# Altium project EE4951_BPM_REV_A.PrjPcb
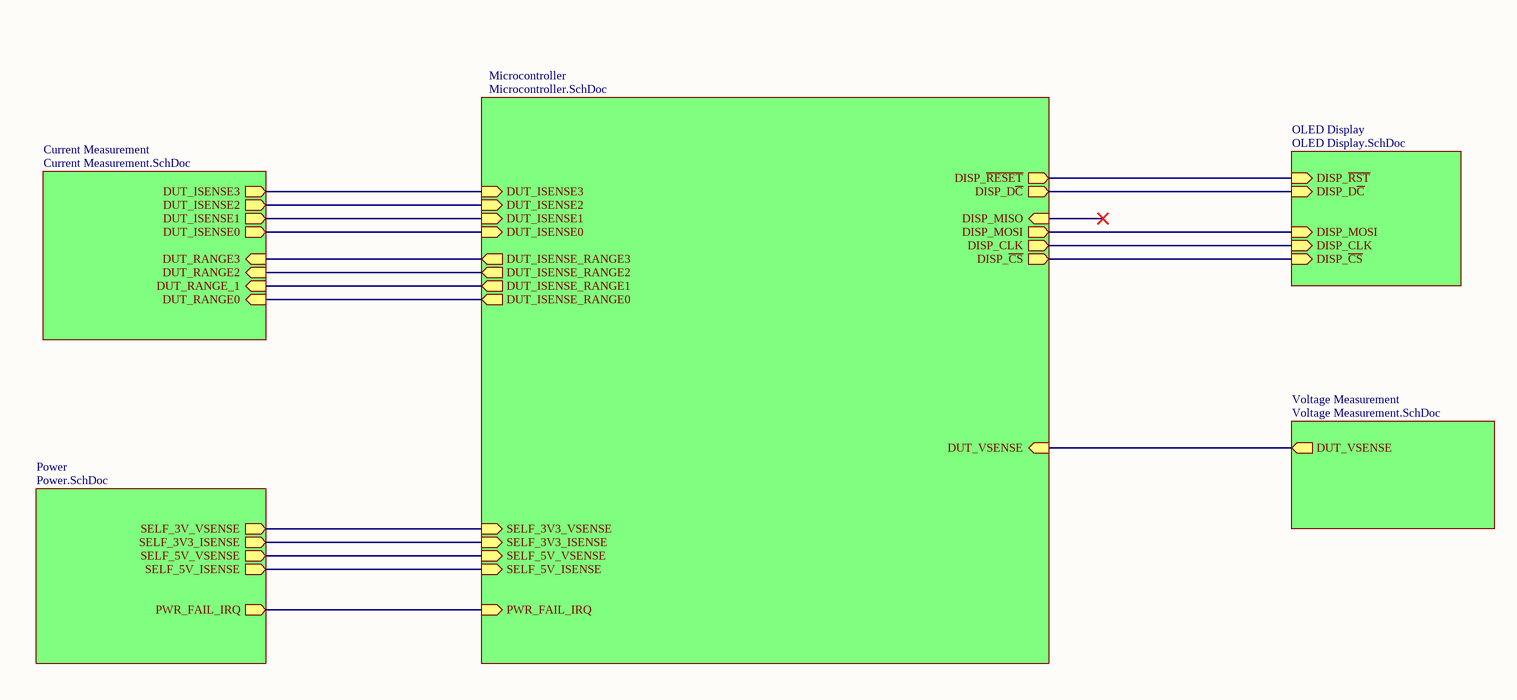
[diagram p0: Heirarchy.SchDoc, left]
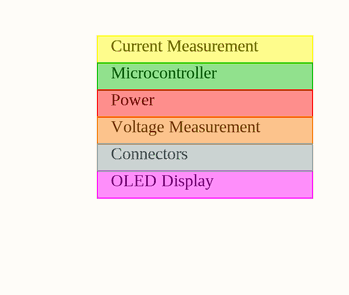
[diagram p1: Heirarchy.SchDoc, right]
6 sheets, 227 parts. Net scope: hierarchical (ports join the sheet entries above them; power ports are global).
Board file: EE4951_BPM_REVA.PcbDoc
Sheets:
  Heirarchy.SchDoc
    Current Measurement = Current Measurement.SchDoc
    Microcontroller = Microcontroller.SchDoc
    Power = Power.SchDoc
    Voltage Measurement = Voltage Measurement.SchDoc
    OLED Display = OLED Display.SchDoc

## Sheet Heirarchy.SchDoc
size D; DrawnBy: Ross Harvey; Engineer: Ross Harvey; Revision: A; SheetNumber: 1; SheetTotal: 7

### Sub-sheets
Current Measurement = Current Measurement.SchDoc: DUT_ISENSE2 (out), DUT_ISENSE1 (out), DUT_RANGE2 (in), DUT_RANGE0 (in), DUT_ISENSE3 (out), DUT_RANGE3 (in), DUT_RANGE_1 (in), DUT_ISENSE0 (out)
Microcontroller = Microcontroller.SchDoc: DISP_MISO (in), SELF_3V3_ISENSE (in), DISP_CLK (out), PWR_FAIL_IRQ (in), DISP_~{CS} (out), DUT_ISENSE_RANGE1 (out), SELF_5V_VSENSE (in), DUT_ISENSE_RANGE0 (out), DISP_MOSI (out), SELF_5V_ISENSE (in), DUT_VSENSE (in), DUT_ISENSE_RANGE2 (out), DISP_D~{C} (out), DUT_ISENSE_RANGE3 (out), DUT_ISENSE0 (in), DISP_~{RESET} (out), DUT_ISENSE2 (in), DUT_ISENSE3 (in), DUT_ISENSE1 (in), SELF_3V3_VSENSE (in)
OLED Display = OLED Display.SchDoc: DISP_~{CS} (in), DISP_CLK (in), DISP_MOSI (in), DISP_~{RST} (in), DISP_D~{C} (in)
Power = Power.SchDoc: SELF_5V_VSENSE (out), SELF_5V_ISENSE (out), SELF_3V3_ISENSE (out), PWR_FAIL_IRQ (out), SELF_3V_VSENSE (out)
Voltage Measurement = Voltage Measurement.SchDoc: DUT_VSENSE (out)

### Nets
DISP_~{CS}: sheet Microcontroller/DISP_~{CS}, sheet OLED Display/DISP_~{CS}
DISP_CLK: sheet Microcontroller/DISP_CLK, sheet OLED Display/DISP_CLK
DISP_MOSI: sheet Microcontroller/DISP_MOSI, sheet OLED Display/DISP_MOSI
DUT_ISENSE0: sheet Current Measurement/DUT_ISENSE0, sheet Microcontroller/DUT_ISENSE0
DUT_ISENSE1: sheet Current Measurement/DUT_ISENSE1, sheet Microcontroller/DUT_ISENSE1
DUT_ISENSE2: sheet Current Measurement/DUT_ISENSE2, sheet Microcontroller/DUT_ISENSE2
DUT_ISENSE3: sheet Current Measurement/DUT_ISENSE3, sheet Microcontroller/DUT_ISENSE3
DUT_ISENSE_RANGE0: sheet Current Measurement/DUT_RANGE0, sheet Microcontroller/DUT_ISENSE_RANGE0
DUT_ISENSE_RANGE1: sheet Current Measurement/DUT_RANGE_1, sheet Microcontroller/DUT_ISENSE_RANGE1
DUT_ISENSE_RANGE2: sheet Current Measurement/DUT_RANGE2, sheet Microcontroller/DUT_ISENSE_RANGE2
DUT_ISENSE_RANGE3: sheet Current Measurement/DUT_RANGE3, sheet Microcontroller/DUT_ISENSE_RANGE3
DUT_VSENSE: sheet Microcontroller/DUT_VSENSE, sheet Voltage Measurement/DUT_VSENSE
PWR_FAIL_IRQ: sheet Microcontroller/PWR_FAIL_IRQ, sheet Power/PWR_FAIL_IRQ
SELF_3V3_ISENSE: sheet Microcontroller/SELF_3V3_ISENSE, sheet Power/SELF_3V3_ISENSE
SELF_3V3_VSENSE: sheet Microcontroller/SELF_3V3_VSENSE, sheet Power/SELF_3V_VSENSE
SELF_5V_ISENSE: sheet Microcontroller/SELF_5V_ISENSE, sheet Power/SELF_5V_ISENSE
SELF_5V_VSENSE: sheet Microcontroller/SELF_5V_VSENSE, sheet Power/SELF_5V_VSENSE
NetU1_79: sheet Microcontroller/DISP_~{RESET}, sheet OLED Display/DISP_~{RST}
NetU1_80: sheet Microcontroller/DISP_D~{C}, sheet OLED Display/DISP_D~{C}

### Notes on the sheet
- Current Measurement
- Microcontroller
- Power
- Voltage Measurement
- Connectors
- OLED Display

## Sheet Current Measurement.SchDoc
size C; DrawnBy: Ross Harvey; Engineer: Ross Harvey; Revision: A; SheetNumber: 2; SheetTotal: 7
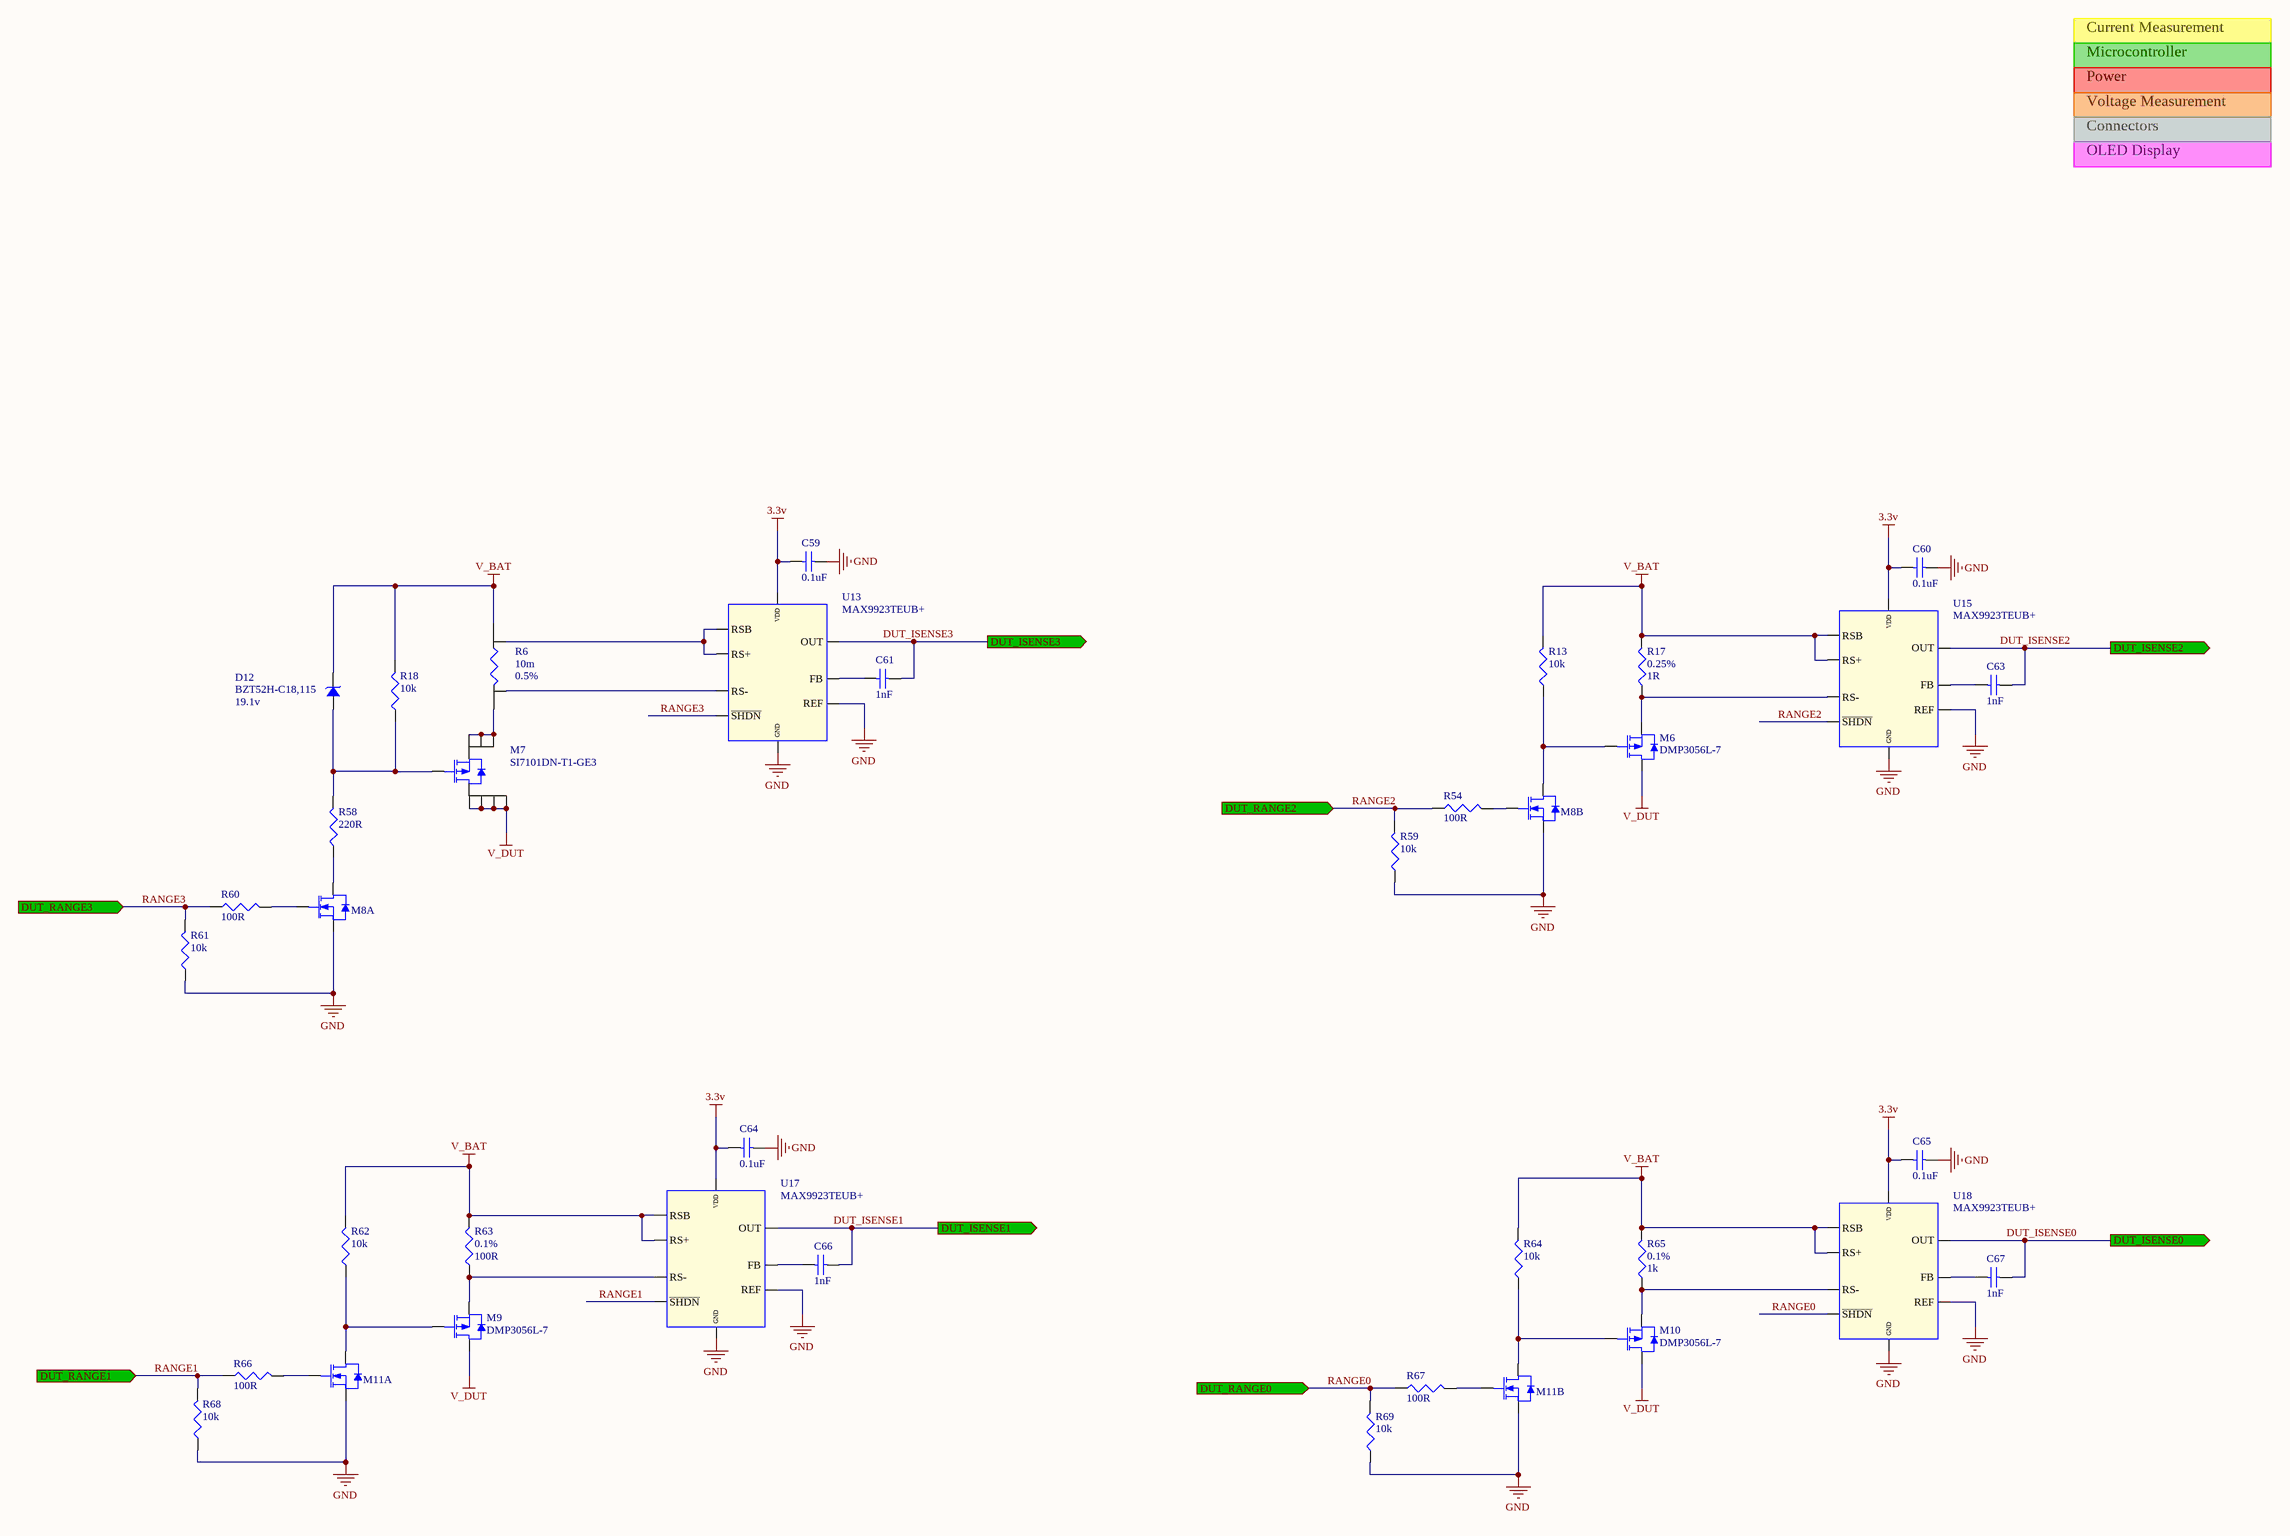
[diagram p2: Current Measurement.SchDoc]

### Parts
C59  0.1uF  [CAP0402R]
C60  0.1uF  [CAP0402R]
C61  1nF  [CAP0402R]
C63  1nF  [CAP0402R]
C64  0.1uF  [CAP0402R]
C65  0.1uF  [CAP0402R]
C66  1nF  [CAP0402R]
C67  1nF  [CAP0402R]
D12  BZT52H-C18,115  OPER_VOLTAGE: 19.1v  [SOD-123]
M6  DMP3056L-7  [SOT23-3M]
M7  SI7101DN-T1-GE3  [PowerPAK-1212-8]
M8  NX3020NAKV,115  [SOT666-6N]  (value not drawn)  (parts A,B of 2)
M9  DMP3056L-7  [SOT23-3M]
M10  DMP3056L-7  [SOT23-3M]
M11  NX3020NAKV,115  [SOT666-6N]  (value not drawn)  (parts A,B of 2)
R6  10m  TOLERANCE: 0.5%  [2512 4 Terminal]
R13  10k  [RES0603R]
R17  Tolerance: 0.25%  [RES0805R]  (hidden comment: 1R)
R18  10k  [RES0603R]
R54  100R  [RES0402R]
R58  220R  [RES0603R]
R59  10k  [RES0402R]
R60  100R  [RES0402R]
R61  10k  [RES0402R]
R62  10k  [RES0603R]
R63  Tolerance: 0.1%  [RES0603W]  (hidden comment: 100R)
R64  10k  [RES0603R]
R65  Tolerance: 0.1%  [RES0603W]  (hidden comment: 1k)
R66  100R  [RES0402R]
R67  100R  [RES0402R]
R68  10k  [RES0402R]
R69  10k  [RES0402R]
U13  MAX9923TEUB+  [uMAX10]
U15  MAX9923TEUB+  [uMAX10]
U17  MAX9923TEUB+  [uMAX10]
U18  MAX9923TEUB+  [uMAX10]

### Ports
DUT_ISENSE0 (out), DUT_ISENSE1 (out), DUT_ISENSE2 (out), DUT_ISENSE3 (out), DUT_RANGE0 (in), DUT_RANGE1 (in), DUT_RANGE2 (in), DUT_RANGE3 (in)

### Nets
3.3v: C59.1 C60.1 C64.1 C65.1 U13.10(VDD) U15.10(VDD) U17.10(VDD) U18.10(VDD)
GND: C59.2 C60.2 C64.2 C65.2 M8.1(S1) M8.4(S2) M11.1(S1) M11.4(S2) R59.1 R61.1 R68.1 R69.1 U13.5(GND) U13.7(REF) U15.5(GND) U15.7(REF) U17.5(GND) U17.7(REF) U18.5(GND) U18.7(REF)
V_BAT: D12.1(K) R6.3 R13.2 R17.2 R18.2 R62.2 R63.2 R64.2 R65.2 U15.1(RSB) U15.2(RS+) U17.1(RSB) U17.2(RS+) U18.1(RSB) U18.2(RS+)
V_DUT: M6.3(SOURCE) M7.5 M7.6 M7.7 M7.8 M9.3(SOURCE) M10.3(SOURCE)
DUT_ISENSE0: C67.2 U18.9(OUT) ; port DUT_ISENSE0
DUT_ISENSE1: C66.2 U17.9(OUT) ; port DUT_ISENSE1
DUT_ISENSE2: C63.2 U15.9(OUT) ; port DUT_ISENSE2
DUT_ISENSE3: C61.2 U13.9(OUT) ; port DUT_ISENSE3
RANGE0: R67.1 R69.2 U18.6(~{SHDN}) ; port DUT_RANGE0  [project net DUT_ISENSE_RANGE0]
RANGE1: R66.1 R68.2 U17.6(~{SHDN}) ; port DUT_RANGE1
RANGE2: R54.1 R59.2 U15.6(~{SHDN}) ; port DUT_RANGE2  [project net DUT_ISENSE_RANGE2]
RANGE3: R60.1 R61.2 U13.6(~{SHDN}) ; port DUT_RANGE3  [project net DUT_ISENSE_RANGE3]
NetC61_1: C61.1 U13.8(FB)
NetC63_1: C63.1 U15.8(FB)
NetC66_1: C66.1 U17.8(FB)
NetC67_1: C67.1 U18.8(FB)
NetD12_2: D12.2(A) M7.4 R18.1 R58.2
NetM6_1: M6.1(GATE) M8.3(D2) R13.1
NetM6_2: M6.2(DRAIN) R17.1 U15.3(RS-)
NetM7_1: M7.1 M7.2 M7.3 R6.1
NetM8_2: M8.2(G1) R60.2
NetM8_5: M8.5(G2) R54.2
NetM8_6: M8.6(D1) R58.1
NetM9_1: M9.1(GATE) M11.6(D1) R62.1
NetM9_2: M9.2(DRAIN) R63.1 U17.3(RS-)
NetM10_1: M10.1(GATE) M11.3(D2) R64.1
NetM10_2: M10.2(DRAIN) R65.1 U18.3(RS-)
NetM11_2: M11.2(G1) R66.2
NetM11_5: M11.5(G2) R67.2
NetR6_2: R6.2 U13.3(RS-)
NetR6_4: R6.4 U13.1(RSB) U13.2(RS+)

Not connected (* = marked no-connect by the designer): U13 4(NC); U15 4(NC); U17 4(NC); U18 4(NC)

### Notes on the sheet
- Current Measurement
- Microcontroller
- Power
- Voltage Measurement
- Connectors
- OLED Display

### Library data of the parts
C59 C60 C64 C65 = 0.1uF (0402): Tolerance: 20%; MFG_PN: VJ0402G104MXQCW1BC; MFG: Vishay; Voltage: 10v; LOAD: NL; Value: 0.1uF
C61 C63 C66 C67 = 1nF (0402): Tolerance: 10%; MFG_PN: VJ0402Y102KXAAC; MFG: Vishay; Voltage: 50v; LOAD: NL; Value: 1nF
D12 = BZT52H-C18: 19.1v Zener Diode; MFG: NXP; LOAD: NL; CURRENT: 250mA; MFG_PN: BZT52H-C18,115
M6 M9 M10 = DMP3056L: PFET_SINGLE_4.3A_30v; LOAD: NL; MFG: DIODES_INC; VDS_MAX: -30v; I_MAX: -4.3A; VGS_MAX: 25v; P_MAX: 1.38W; RDS_ON: 35m; VGS_TH: -1v; MFG_PN: DMP3056L-7
M7 = SI7101DN: PFET_SINGLE_35A_30v; MFG: VISHAY; LOAD: NL; CURRENT: 35A; VGS_MAX: 20V; VDS_MAX: 30V; RDS: 7.2m; POWER: 52W; MFG_PN: SI7101DN-T1-GE3
M8 M11 = NX3020NAKV: NFET_DUAL_200mA_30v; LOAD: NL; MFG: NXP; VDS_MAX: 30v; I_MAX: 200mA; P_MAX: 1.1W; RDS_ON: 2.7; VGS_MAX: *; MFG_PN: NX3020NAKV,115
R6 = 10m 0.5% (2512 4-Terminal): 10mR Current Sense - 4-Terminal; MFG_PN: WSK2512R0100DEA; MFG: VISHAY; POWER: 1W; LOAD: NL; VALUE: 10m
R13 R18 R62 R64 = 10K (0603): Tolerance: 1%; POWER: 0.1W; MFG_PN: CRCW060310K0FKEA; MFG: Vishay; Load: NL; Value: 10k
R17 = 1R 0.25% (0805): POWER: 100mW; MFG_PN: CRT0805-CY-1R00ELF; MFG: Bourns; Load: NL; Value: 1R
R54 R60 R66 R67 = 100R (0402): Tolerance: 1%; POWER: 63mW; MFG_PN: CRCW0402100RFKED; MFG: Vishay; Load: NL; Value: 100R
R58 = 220R (0603): Tolerance: 1%; POWER: 0.1W; MFG_PN: CRCW0603220RFKEB; MFG: Vishay; Load: NL; Value: 220R
R59 R61 R68 R69 = 10k (0402): Tolerance: 1%; POWER: 63mW; MFG_PN: CRCW040210K0FKED; MFG: Vishay; Load: NL; Value: 10k
R63 = 100R   0.1% (0603): POWER: 0.1W; MFG_PN: TNPW0603100RBEEA; MFG: Vishay; Load: NL; TEMP_COEF: 20ppm; Value: 100R
R65 = 1k   0.1% (0603): POWER: 0.1W; MFG_PN: TNPW06031K00BEEA; MFG: Vishay; Load: NL; TEMP_COEF: 25ppm; Value: 1k
U13 U15 U17 U18 = MAX9923TEUB+: Ultra-Precision High Side Current Shunt Amp; LOAD: NL; MFG: MAXIM; GBW: 50kHz; Vos: 25uV; Ib: 1pA; GAIN: 25V/V; MFG_PN: MAX9923TEUB+

## Sheet Microcontroller.SchDoc
size D; DrawnBy: Ross Harvey; Engineer: Ross Harvey; Revision: A; SheetNumber: 3; SheetTotal: 7
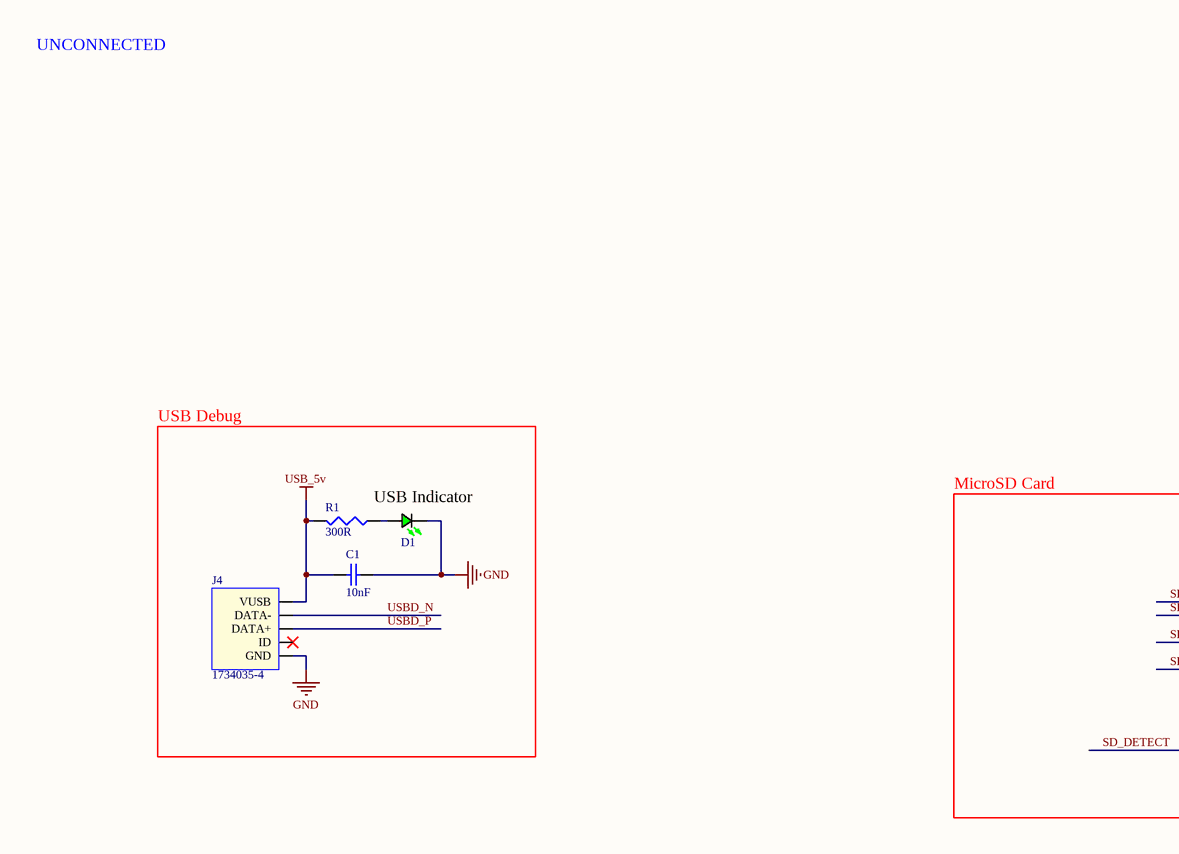
[diagram p3: Microcontroller.SchDoc, top left]
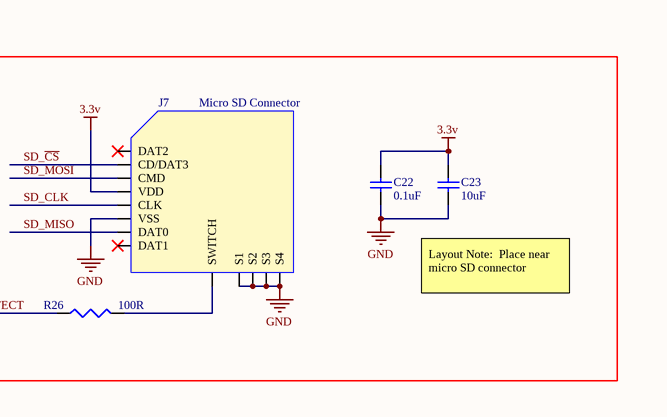
[diagram p4: Microcontroller.SchDoc, top middle]
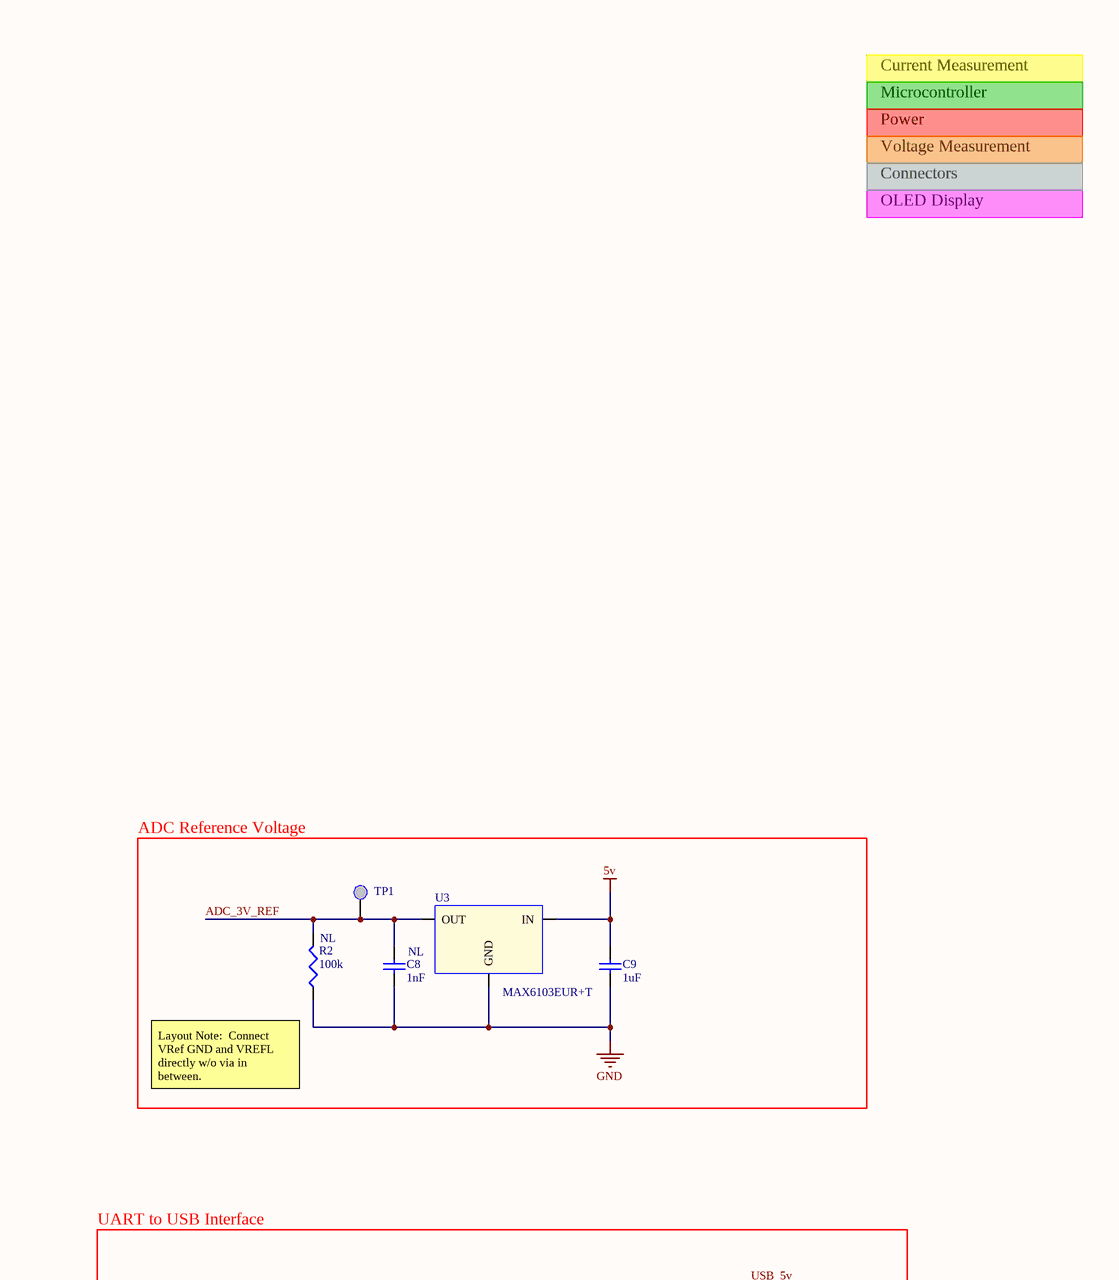
[diagram p5: Microcontroller.SchDoc, top right]
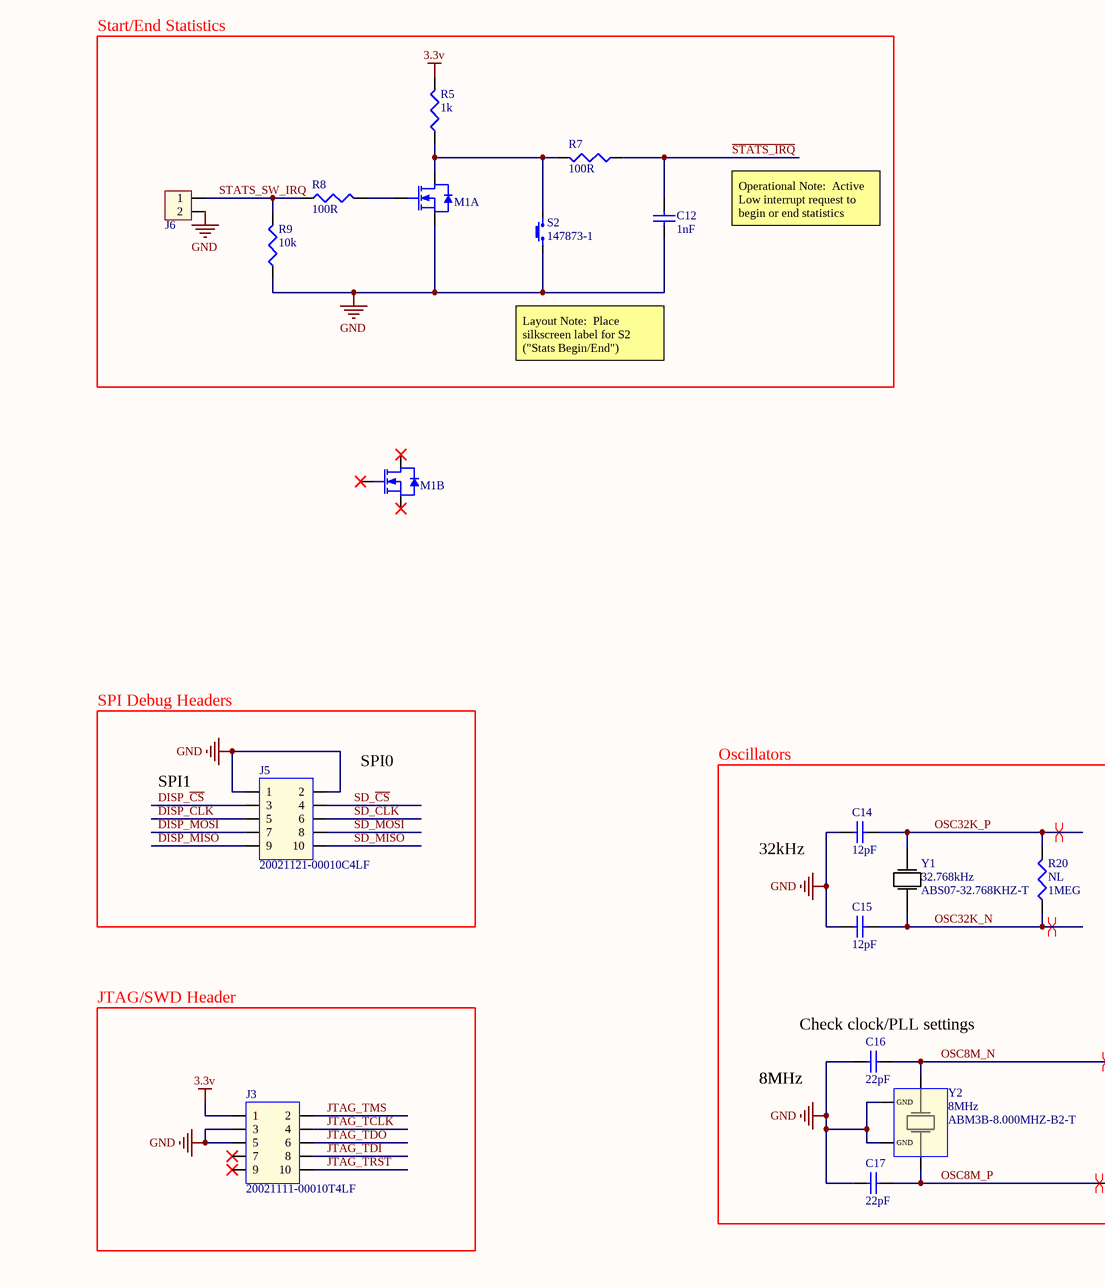
[diagram p6: Microcontroller.SchDoc, bottom left]
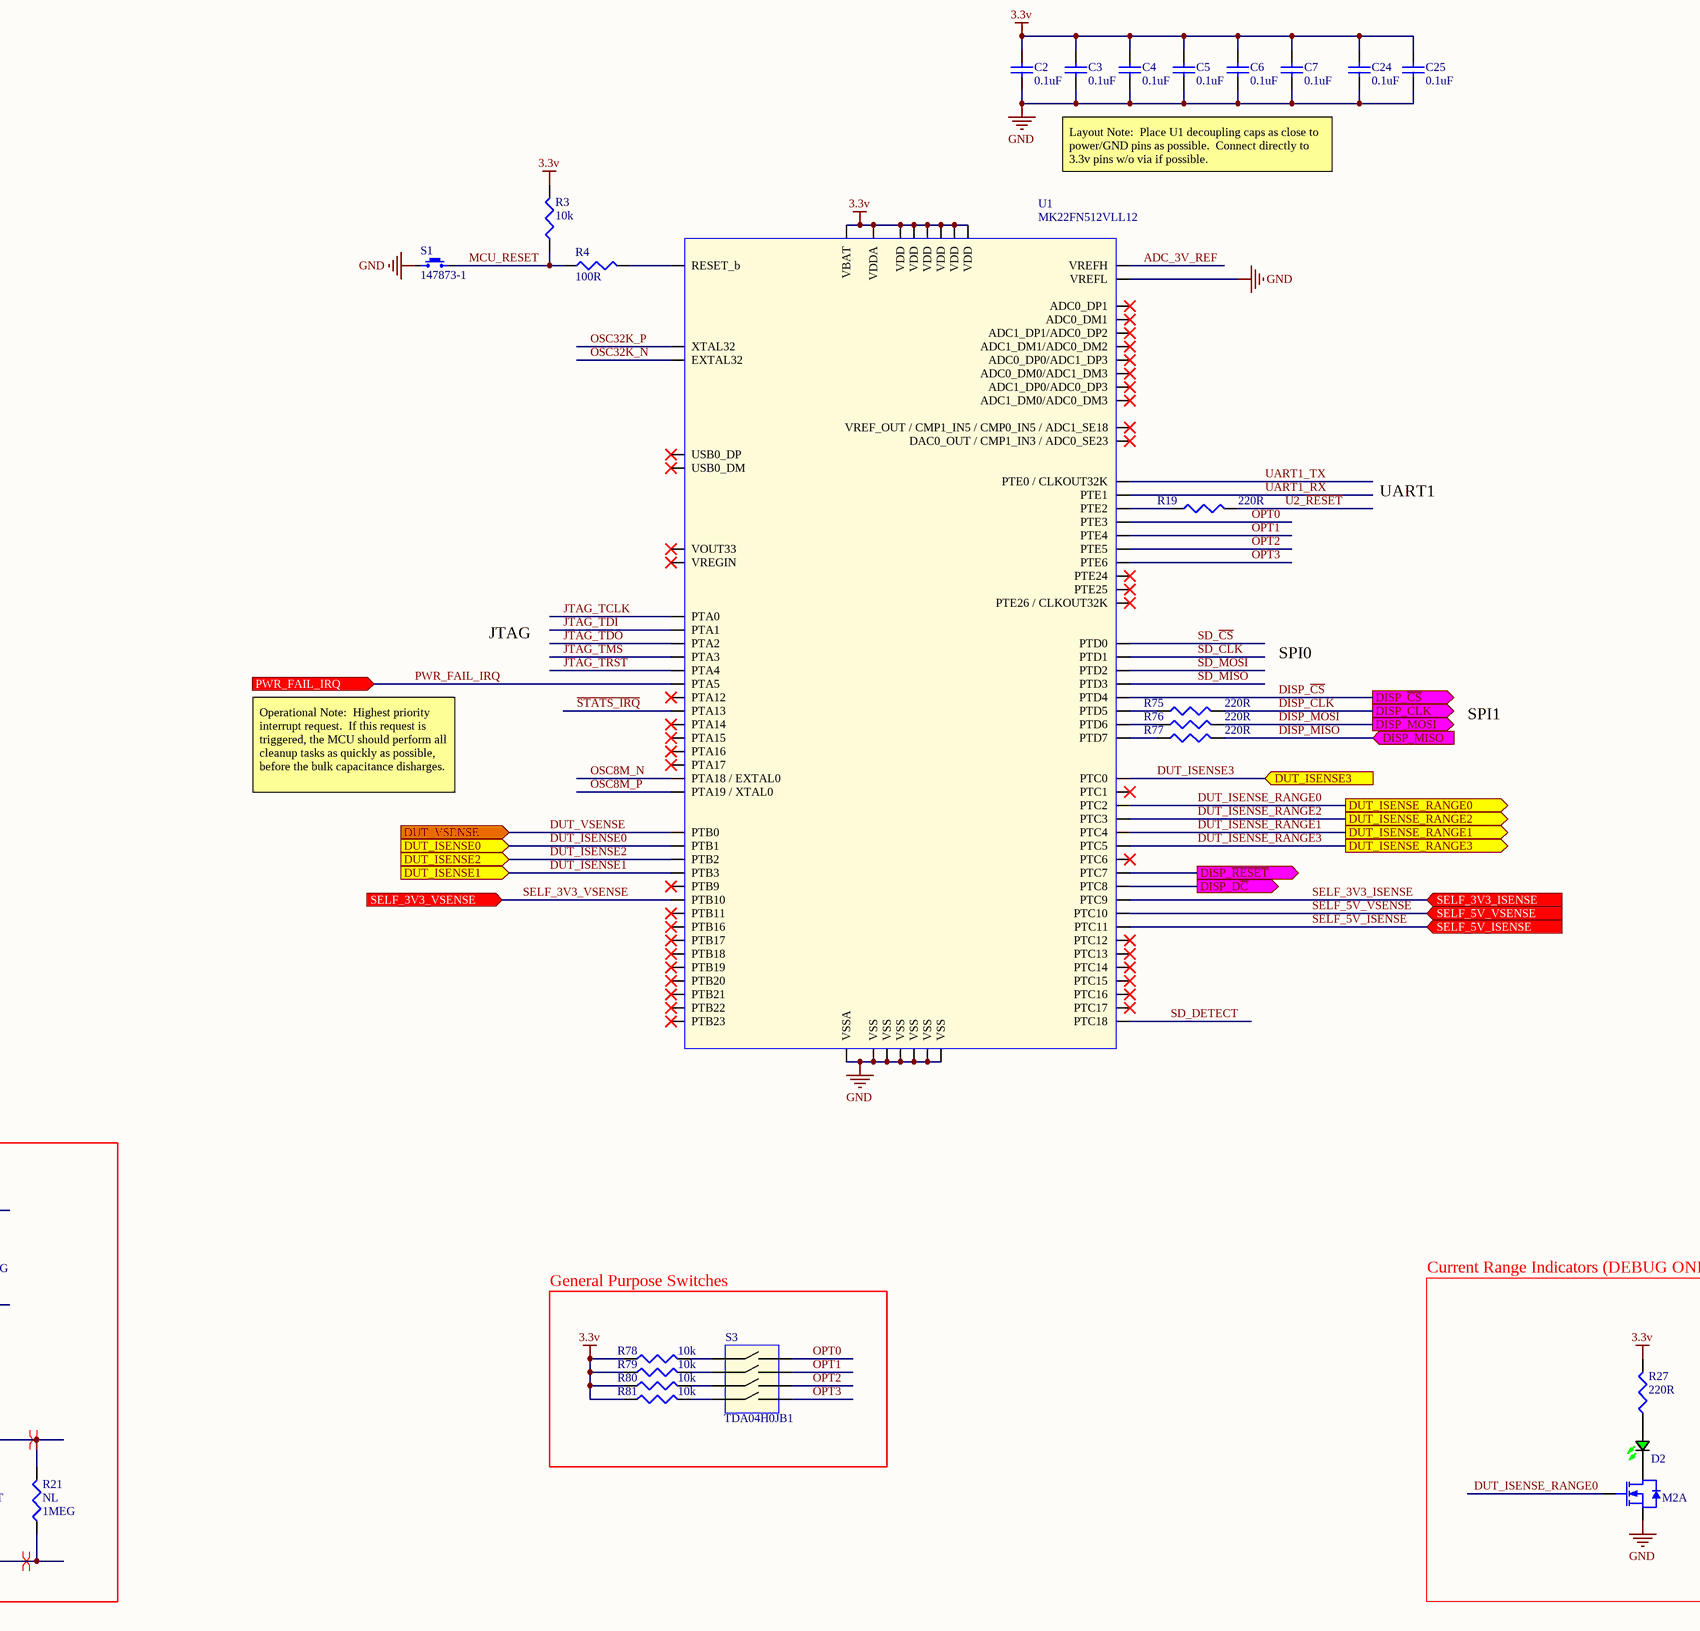
[diagram p7: Microcontroller.SchDoc, bottom middle]
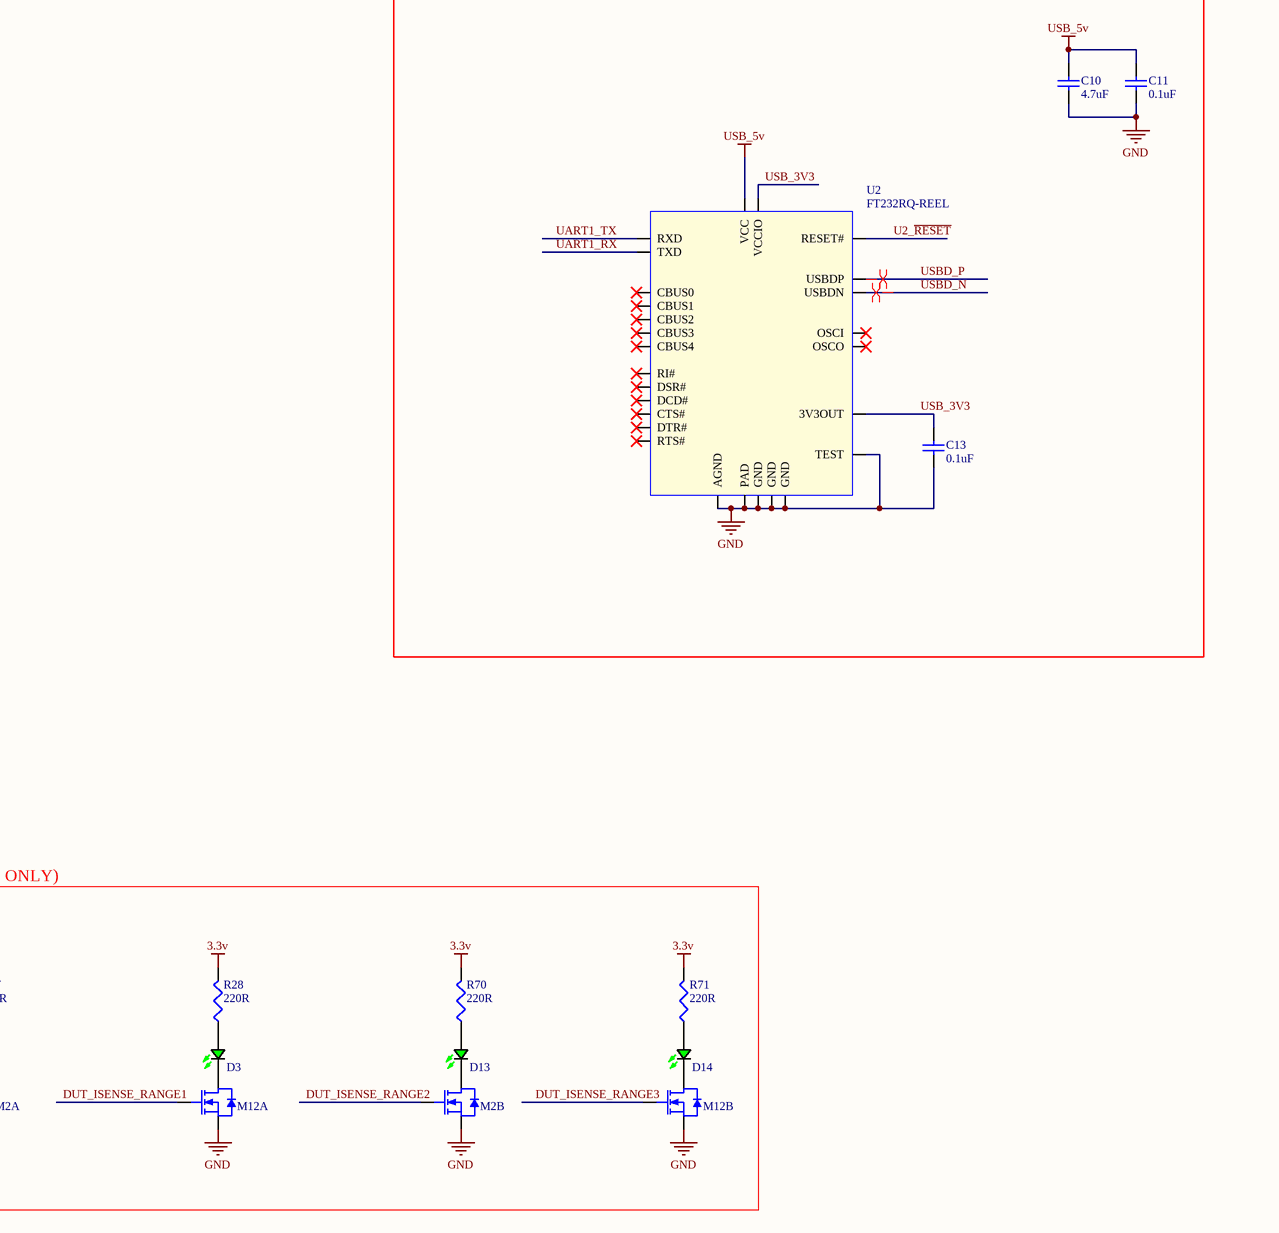
[diagram p8: Microcontroller.SchDoc, bottom right]

### Parts
C1  10nF  [CAP0402R]
C2  0.1uF  [CAP0402R]
C3  0.1uF  [CAP0402R]
C4  0.1uF  [CAP0402R]
C5  0.1uF  [CAP0402R]
C6  0.1uF  [CAP0402R]
C7  0.1uF  [CAP0402R]
C8  LOAD: NL  [CAP0402R]  (hidden comment: 1nF)
C9  1uF  [CAP0603R]
C10  4.7uF  [CAP0805R]
C11  0.1uF  [CAP0402R]
C12  1nF  [CAP0402R]
C13  0.1uF  [CAP0402R]
C14  12pF  [CAP0402R]
C15  12pF  [CAP0402R]
C16  22pF  [CAP0402R]
C17  22pF  [CAP0402R]
C22  0.1uF  [CAP0402R]
C23  10uF  [CAP1206R]
C24  0.1uF  [CAP0402R]
C25  0.1uF  [CAP0402R]
D1  LTST-S270KGKT  [LED Green 0603]  (value not drawn)
D2  LTST-S270KGKT  [LED Green 0603]  (value not drawn)
D3  LTST-S270KGKT  [LED Green 0603]  (value not drawn)
D13  LTST-S270KGKT  [LED Green 0603]  (value not drawn)
D14  LTST-S270KGKT  [LED Green 0603]  (value not drawn)
J3  20021111-00010T4LF  [2x5 Header (1.27mm)]
J4  1734035-4  [USB MINI-B 1734035-4]
J5  20021121-00010C4LF  [2x5 JTAG Header]
J6  1x2 Header  [1x2 Header]  (value not drawn)
J7  Micro SD Connector  [MICROSD_1050270001]
M1  NX3020NAKV,115  [SOT666-6N]  (value not drawn)  (parts A,B of 2)
M2  NX3020NAKV,115  [SOT666-6N]  (value not drawn)  (parts A,B of 2)
M12  NX3020NAKV,115  [SOT666-6N]  (value not drawn)  (parts A,B of 2)
R1  300R  [RES0402R]
R2  Load: NL  [RES0402R]  (hidden comment: 100k)
R3  10k  [RES0402R]
R4  100R  [RES0402R]
R5  1k  [RES0402R]
R7  100R  [RES0402R]
R8  100R  [RES0402R]
R9  10k  [RES0402R]
R19  220R  [RES0402R]
R20  Load: NL  [RES0402R]  (hidden comment: 1MEG)
R21  Load: NL  [RES0402R]  (hidden comment: 1MEG)
R26  100R  [RES0402R]
R27  220R  [RES0402R]
R28  220R  [RES0402R]
R70  220R  [RES0402R]
R71  220R  [RES0402R]
R75  220R  [RES0402R]
R76  220R  [RES0402R]
R77  220R  [RES0402R]
R78  10k  [RES0402R]
R79  10k  [RES0402R]
R80  10k  [RES0402R]
R81  10k  [RES0402R]
S1  147873-1  [TECONN_14783-1]
S2  147873-1  [TECONN_14783-1]
S3  TDA04H0JB1  [TDA04H0JB1 4xSPST]
TP1  NONE  [TESTPOINT - 1.5mm Round Pad]  (value not drawn)
U1  MK22FN512VLL12  [LQFP100 0.5mm 14mmx14mm]
U2  FT232RQ-REEL  [QFN32]
U3  MAX6103EUR+T  [SOT23-3M]
Y1  32.768kHz  [ABS07-32.768KHZ-T]
Y2  8MHz  MFG_PN: ABM3B-8.000MHZ-B2-T  [ABMM2-8.000MHZ-B2-T]

### Blocks framed on the sheet
MicroSD Card: C22 C23 J7 R26
ADC Reference Voltage: C8 C9 R2 TP1 U3
UART to USB Interface: C10 C11 C13 U2
Start/End Statistics: C12 J6 M1 R5 R7-R9 S2
General Purpose Switches: R78-R81 S3
Current Range Indicators (DEBUG ONLY): D2 D3 D13 D14 M2 M12 R27 R28 R70 R71
JTAG/SWD Header: J3

### Ports
DISP_CLK (out), DISP_D~{C} (out), DISP_MISO (in), DISP_MOSI (out), DISP_~{CS} (out), DISP_~{RESET} (out), DUT_ISENSE0 (in), DUT_ISENSE1 (in), DUT_ISENSE2 (in), DUT_ISENSE3 (in), DUT_ISENSE_RANGE0 (out), DUT_ISENSE_RANGE1 (out), DUT_ISENSE_RANGE2 (out), DUT_ISENSE_RANGE3 (out), DUT_VSENSE (in), PWR_FAIL_IRQ (in), SELF_3V3_ISENSE (in), SELF_3V3_VSENSE (in), SELF_5V_ISENSE (in), SELF_5V_VSENSE (in)

### Nets
3.3v: C2.1 C3.1 C4.1 C5.1 C6.1 C7.1 C22.1 C23.2 C24.1 C25.1 J3.1 J7.P4(VDD) R3.2 R5.2 R27.2 R28.2 R70.2 R71.2 R78.1 R79.1 R80.1 R81.1 U1.8(VDD) U1.22(VDDA) U1.30(VBAT) U1.40(VDD) U1.48(VDD) U1.61(VDD) U1.75(VDD) U1.89(VDD)
5v: C9.1 U3.1(IN)
GND: C1.2 C2.2 C3.2 C4.2 C5.2 C6.2 C7.2 C8.2 C9.2 C10.2 C11.2 C12.2 C13.1 C14.1 C15.1 C16.1 C17.1 C22.2 C23.1 C24.2 C25.2 D1.1(K) J3.3 J3.5 J4.5(GND) J4.SH1 J4.SH2 J4.SH3 J4.SH4 J5.1 J5.2 J6.2 J7.P6(VSS) J7.S1 J7.S2 J7.S3 J7.S4 M1.1(S1) M2.1(S1) M2.4(S2) M12.1(S1) M12.4(S2) R2.1 R9.1 S1.1 S2.1 U1.9(VSS) U1.24(VREFL) U1.25(VSSA) U1.41(VSS) U1.49(VSS) U1.60(VSS) U1.74(VSS) U1.88(VSS) U2.0(PAD) U2.4(GND) U2.17(GND) U2.20(GND) U2.24(AGND) U2.26(TEST) U3.3(GND) Y2.1(GND) Y2.3(GND)
USB_5v: C1.1 C10.1 C11.1 J4.1(VUSB) R1.2 U2.19(VCC)
ADC_3V_REF: C8.1 R2.2 TP1.1 U1.23(VREFH) U3.2(OUT)
DISP_~{CS}: J5.3 U1.97(PTD4) ; port DISP_~{CS}
DISP_CLK: J5.5 R75.2 ; port DISP_CLK
DISP_MISO: J5.9 R77.2 ; port DISP_MISO
DISP_MOSI: J5.7 R76.2 ; port DISP_MOSI
DUT_ISENSE0: U1.54(PTB1) ; port DUT_ISENSE0
DUT_ISENSE1: U1.56(PTB3) ; port DUT_ISENSE1
DUT_ISENSE2: U1.55(PTB2) ; port DUT_ISENSE2
DUT_ISENSE3: U1.70(PTC0) ; port DUT_ISENSE3
DUT_ISENSE_RANGE0: M2.2(G1) U1.72(PTC2) ; port DUT_ISENSE_RANGE0
DUT_ISENSE_RANGE1: M12.2(G1) U1.76(PTC4) ; port DUT_ISENSE_RANGE1
DUT_ISENSE_RANGE2: M2.5(G2) U1.73(PTC3) ; port DUT_ISENSE_RANGE2
DUT_ISENSE_RANGE3: M12.5(G2) U1.77(PTC5) ; port DUT_ISENSE_RANGE3
DUT_VSENSE: U1.53(PTB0) ; port DUT_VSENSE
JTAG_TCLK: J3.4 U1.34(PTA0)
JTAG_TDI: J3.8 U1.35(PTA1)
JTAG_TDO: J3.6 U1.36(PTA2)
JTAG_TMS: J3.2 U1.37(PTA3)
JTAG_TRST: J3.10 U1.38(PTA4)
MCU_RESET: R3.1 R4.1 S1.2
OPT0: S3.8 U1.4(PTE3)
OPT1: S3.7 U1.5(PTE4)
OPT2: S3.6 U1.6(PTE5)
OPT3: S3.5 U1.7(PTE6)
OSC8M_N: C16.2 R21.2 U1.50(PTA18_/_EXTAL0) Y2.2
OSC8M_P: C17.2 R21.1 U1.51(PTA19_/_XTAL0) Y2.4
OSC32K_N: C15.2 R20.1 U1.29(EXTAL32) Y1.1
OSC32K_P: C14.2 R20.2 U1.28(XTAL32) Y1.2
PWR_FAIL_IRQ: U1.39(PTA5) ; port PWR_FAIL_IRQ
~{STATS_IRQ}: C12.1 R7.1 U1.43(PTA13)
SD_~{CS}: J5.4 J7.P2(CD/DAT3) U1.93(PTD0)
SD_CLK: J5.6 J7.P5(CLK) U1.94(PTD1)
SD_DETECT: R26.1 U1.92(PTC18)
SD_MISO: J5.10 J7.P7(DAT0) U1.96(PTD3)
SD_MOSI: J5.8 J7.P3(CMD) U1.95(PTD2)
SELF_3V3_ISENSE: U1.81(PTC9) ; port SELF_3V3_ISENSE
SELF_3V3_VSENSE: U1.58(PTB10) ; port SELF_3V3_VSENSE
SELF_5V_ISENSE: U1.83(PTC11) ; port SELF_5V_ISENSE
SELF_5V_VSENSE: U1.82(PTC10) ; port SELF_5V_VSENSE
STATS_SW_IRQ: J6.1 R8.1 R9.2
U2_~{RESET}: R19.2 U2.18(RESET#)
UART1_RX: U1.2(PTE1) U2.30(TXD)
UART1_TX: U1.1(PTE0_/_CLKOUT32K) U2.2(RXD)
USB_3V3: C13.2 U2.1(VCCIO) U2.16(3V3OUT)
USBD_N: J4.2(DATA-) U2.15(USBDN)
USBD_P: J4.3(DATA+) U2.14(USBDP)
NetD1_2: D1.2(A) R1.1
NetD2_1: D2.1(K) M2.6(D1)
NetD2_2: D2.2(A) R27.1
NetD3_1: D3.1(K) M12.6(D1)
NetD3_2: D3.2(A) R28.1
NetD13_1: D13.1(K) M2.3(D2)
NetD13_2: D13.2(A) R70.1
NetD14_1: D14.1(K) M12.3(D2)
NetD14_2: D14.2(A) R71.1
NetJ7_G1: J7.G1(SWITCH) R26.2
NetM1_2: M1.2(G1) R8.2
NetM1_6: M1.6(D1) R5.1 R7.2 S2.2
NetR4_2: R4.2 U1.52(RESET_b)
NetR19_1: R19.1 U1.3(PTE2)
NetR75_1: R75.1 U1.98(PTD5)
NetR76_1: R76.1 U1.99(PTD6)
NetR77_1: R77.1 U1.100(PTD7)
NetR78_2: R78.2 S3.1
NetR79_2: R79.2 S3.2
NetR80_2: R80.2 S3.3
NetR81_2: R81.2 S3.4
NetU1_79: U1.79(PTC7) ; port DISP_~{RESET}
NetU1_80: U1.80(PTC8) ; port DISP_D~{C}

Not connected (* = marked no-connect by the designer): J3 7* 9*; J4 4(ID)*; J7 P1(DAT2)* P8(DAT1)*; M1 3(D2)* 4(S2)* 5(G2)*; U1 10(USB0_DP)* 11(USB0_DM)* 12(VOUT33)* 13(VREGIN)* 14(ADC0_DP1)* 15(ADC0_DM1)* 16(ADC1_DP1/ADC0_DP2)* 17(ADC1_DM1/ADC0_DM2)* 18(ADC0_DP0/ADC1_DP3)* 19(ADC0_DM0/ADC1_DM3)* 20(ADC1_DP0/ADC0_DP3)* 21(ADC1_DM0/ADC0_DM3)* 26(VREF_OUT_/_CMP1_IN5_/_CMP0_IN5_/_ADC1_SE18)* 27(DAC0_OUT_/_CMP1_IN3_/_ADC0_SE23)* 31(PTE24)* 32(PTE25)* 33(PTE26_/_CLKOUT32K)* 42(PTA12)* 44(PTA14)* 45(PTA15)* 46(PTA16)* 47(PTA17)* 57(PTB9)* 59(PTB11)* 62(PTB16)* 63(PTB17)* 64(PTB18)* 65(PTB19)* 66(PTB20)* 67(PTB21)* 68(PTB22)* 69(PTB23)* 71(PTC1)* 78(PTC6)* 84(PTC12)* 85(PTC13)* 86(PTC14)* 87(PTC15)* 90(PTC16)* 91(PTC17)*; U2 3(RI#)* 5(NC) 6(DSR#)* 7(DCD#)* 8(CTS#)* 9(CBUS4)* 10(CBUS2)* 11(CBUS3)* 12(NC) 13(NC) 21(CBUS1)* 22(CBUS0)* 23(NC) 25(NC) 27(OSCI)* 28(OSCO)* 29(NC) 31(DTR#)* 32(RTS#)*

### Layout directives
differential pair: OSC8M_N, OSC8M_P, OSC32K_N, OSC32K_P, USBD_N, USBD_P

### Notes on the sheet
- UNCONNECTED
- Current Measurement
- Microcontroller
- Power
- Voltage Measurement
- Connectors
- OLED Display
- USB Debug
- USB Indicator
- Layout Note:  Place near micro SD connector
- Layout Note:  Place U1 decoupling caps as close to power/GND pins as possible.  Connect directly to 3.3v pins w/o via if possible.
- (near R2) Layout Note:  Connect VRef GND and VREFL directly w/o via in between.
- UART1
- Operational Note:  Active Low interrupt request to begin or end statistics
- JTAG
- SPI0
- Layout Note:  Place silkscreen label for S2 ("Stats Begin/End")
- SPI1
- Operational Note:  Highest priority interrupt request.  If this request is triggered, the MCU should perform all cleanup tasks as quickly as possible, before the bulk capacitance disharges.
- SPI Debug Headers
- (near J5) SPI0
- Oscillators
- (near C14) 32kHz
- (near C16) Check clock/PLL settings
- 8MHz

### Library data of the parts
C1 = 10nF (0402): Tolerance: 5%; MFG_PN: VJ0402Y103JXXAC; MFG: Vishay; Voltage: 25v; LOAD: NL; Value: 10nF
C2-C7 C11 C13 C22 C24 C25 = 0.1uF (0402): as C59 on sheet Current Measurement; Value: 0.1uF
C8 = 1nF (0402): Tolerance: 10%; MFG_PN: VJ0402Y102KXAAC; MFG: Vishay; Voltage: 50v; Value: 1nF
C9 = 1uF: MFG_PN: VJ0805V105ZXXTW1BC; MFG: Vishay; Voltage: 25v; LOAD: NL; Value: 1uF
C10 = 4.7uF (0805): MFG_PN: VJ0805V475MXQTW1BC; MFG: Vishay; Voltage: 10v; LOAD: NL; Value: 4.7uF
C12 = 1nF (0402): as C61 on sheet Current Measurement; Value: 1nF
C14 C15 = 12pF (0402): Tolerance: 5%; MFG_PN: GRM1555C1H120JA01D; MFG: Murata; Voltage: 50v; LOAD: NL; Value: 12pF
C16 C17 = 22pF (0402): Tolerance: 5%; MFG_PN: 04025A220JAT2A; MFG: AVX; Voltage: 50v; LOAD: NL; Value: 22pF
C23 = 10uF: MFG1_PN: VJ1206V106ZXQTW1BC; MFG1: Vishay; Voltage: 10v; Value: 10uF
D1-D3 D13 D14 = LED Green 0603: MFG: Lite On; VFORWARD: 2v; CURRENT: 20mA; COLOR: Green; MFG_PN: LTST-S270KGKT
J3 = 2x5 JTAG Header TH: 2x5 JTAG Header TH (1.27mm); LOAD: NL; MFG: FCI; CURRENT: 1A; MFG_PN: 20021111-00010T4LF
J4 = USB Mini-B Female: USB Mini B Female; MFG: TE CONNECTIVITY; CONTACTS: 5; LOAD: NL; MFG_PN: 1734035-4; TYPE: USB Mini B; GENDER: FEMALE
J5 = 2x5 JTAG Header SMD: 2x5 JTAG Header SMD (1.27mm); LOAD: NL; MFG: FCI; CURRENT: 1A; MFG_PN: 20021121-00010C4LF
J6 = 1x2 Header: 1x2 Header, 2.52mm pitch
J7 = MICRO_SD 1050270001: LOAD: NL; MFG: MOLEX; MFG_PN: 1050270001
M1 M2 M12 = NX3020NAKV: as M8 on sheet Current Measurement; VGS_MAX: *; MFG_PN: NX3020NAKV,115
R1 = 300R (0402): Tolerance: 1%; POWER: 63mW; MFG_PN: CRCW0402300RFKED; MFG: Vishay; Load: NL; Value: 300R
R2 = 100k (0402): Tolerance: 1%; POWER: 63mW; MFG_PN: CRCW0402100KFKED; MFG: Vishay; Value: 100k
R3 R9 R78-R81 = 10k (0402): as R59 on sheet Current Measurement; Value: 10k
R4 R7 R8 R26 = 100R (0402): as R54 on sheet Current Measurement; Value: 100R
R5 = 1k (0402): Tolerance: 1%; POWER: 63mW; MFG_PN: CRCW04021K00FKED; MFG: Vishay; Load: NL; Value: 1k
R19 R27 R28 R70 R71 R75-R77 = 220R (0402): Tolerance: 1%; POWER: 63mW; MFG_PN: CRCW0402220RFKED; MFG: Vishay; Load: NL; Value: 220R
R20 R21 = 1MEG (0402): Tolerance: 1%; POWER: 63mW; MFG_PN: CRCW04021M00FKED; MFG: Vishay; Value: 1MEG
S1 S2 = SPST Momentary Micro: Micro SPST Momentary Switch; MFG: TE CONNECTIVITY; LOAD: NL; CURRENT: 50mA; VOLTAGE: 24v; MFG_PN: 147873-1
S3 = 4xSPST Microswitch (1.27mm): SPST Microswitch Array (4 Position); LOAD: NL; MFG: C&K; MFG_PN: TDA04H0JB1
TP1 = Testpoint 1.5mm SMD: 1.5mm Testpoint
U1 = MK22FN512VLL12: 32-bit ARM Cortex-M4 Microcontroller; MFG: FREESCALE; MFG_PN: MK22FN512VLL12
U2 = FT232RQ-REEL: UART Interface/Bridge; MFG: FTDI; MFG_PN: FT232RQ-REEL
U3 = MAX6103EUR+T: Precision 3v Reference; MFG: MAXIM; ACCURACY: 0.4%; LOAD: NL; MFG_PN: MAX6103EUR+T; VOUT: 3v
Y1 = 32kHz Crystal: MFG: ABRACON; CLOAD: 12.5pF; FREQ: 32.768kHz; MFG_PN: ABS07-32.768KHZ-T
Y2 = 8.0MHz Crystal 18pF 20ppm: 8.0MHz Crystal; MFG: ABRACON; CLOAD: 18pF; FREQ: 8MHz

## Sheet Power.SchDoc
size D; DrawnBy: James Redinger/Ross Harvey; Engineer: JR/AB/RH; Revision: A; SheetNumber: 4; SheetTotal: 7
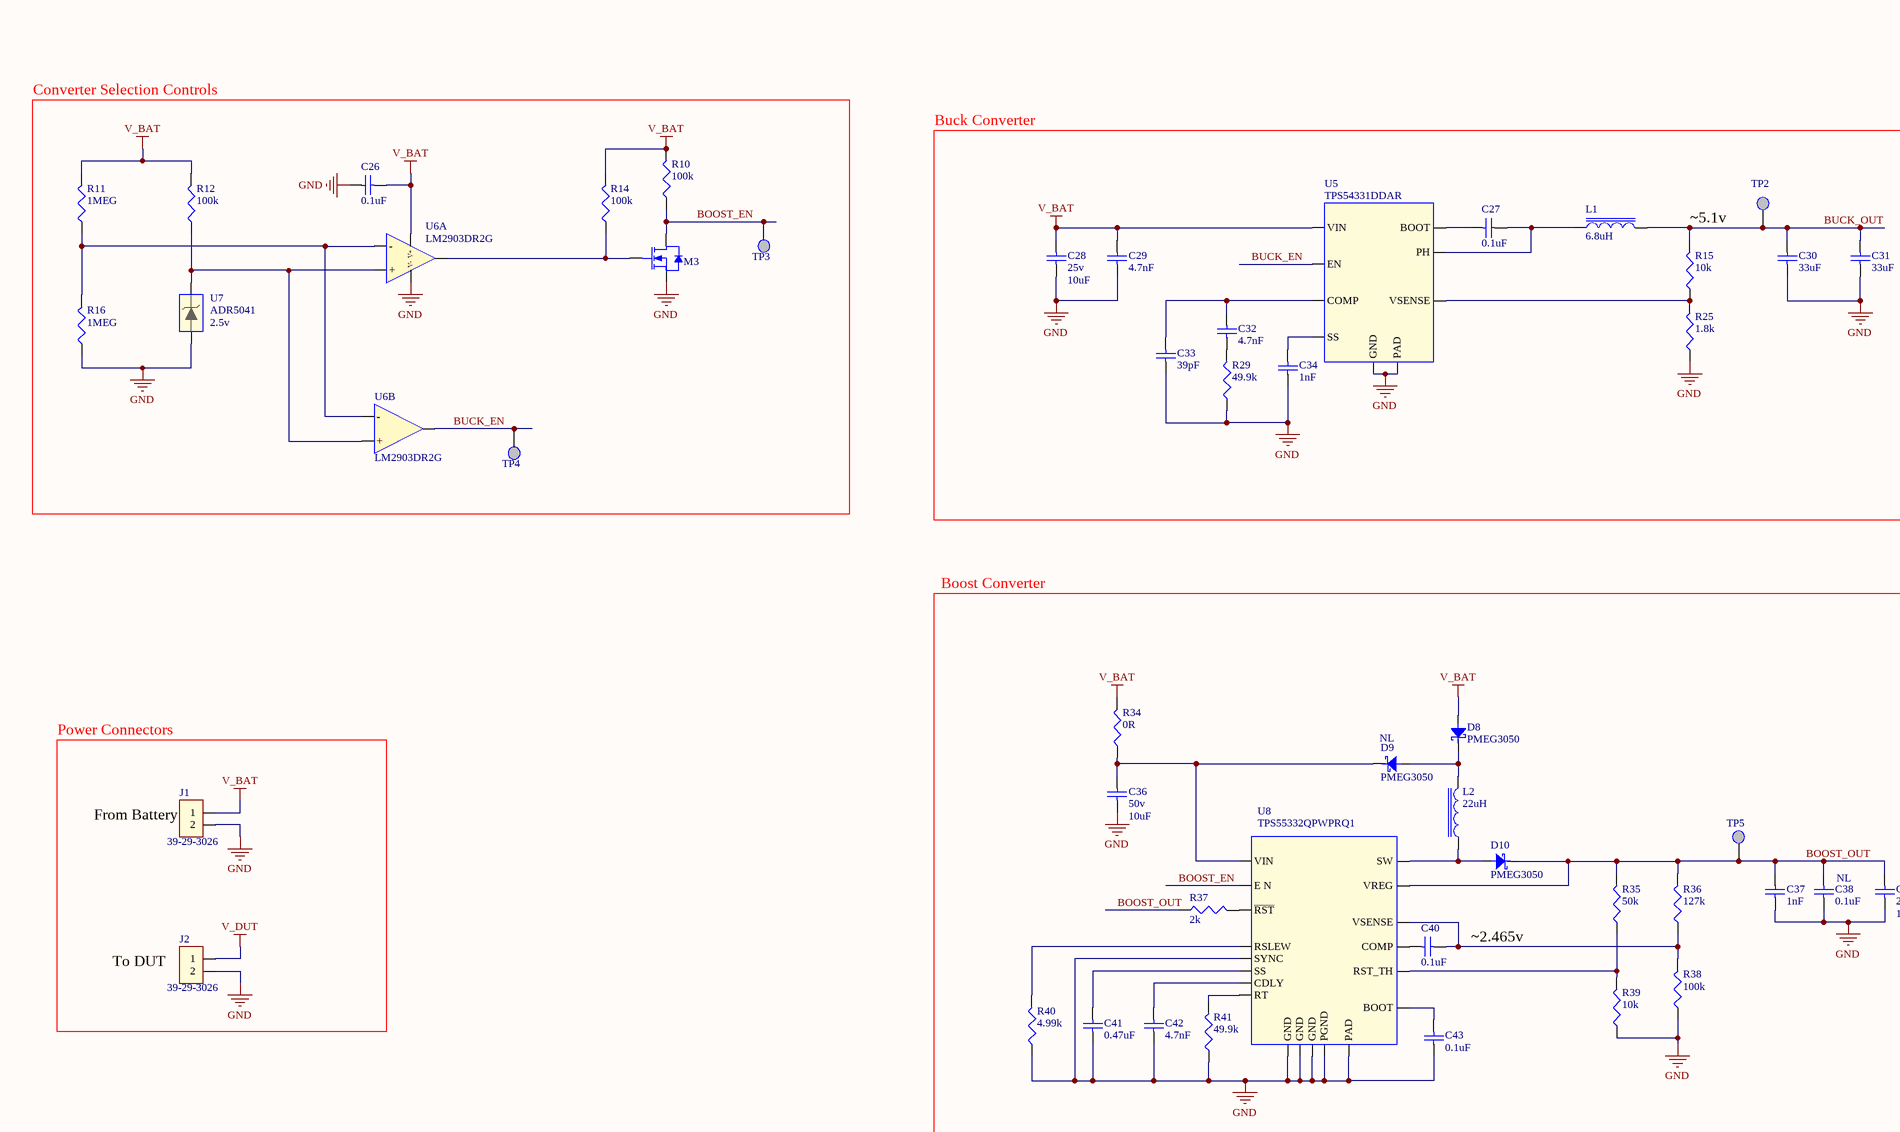
[diagram p9: Power.SchDoc, top left]
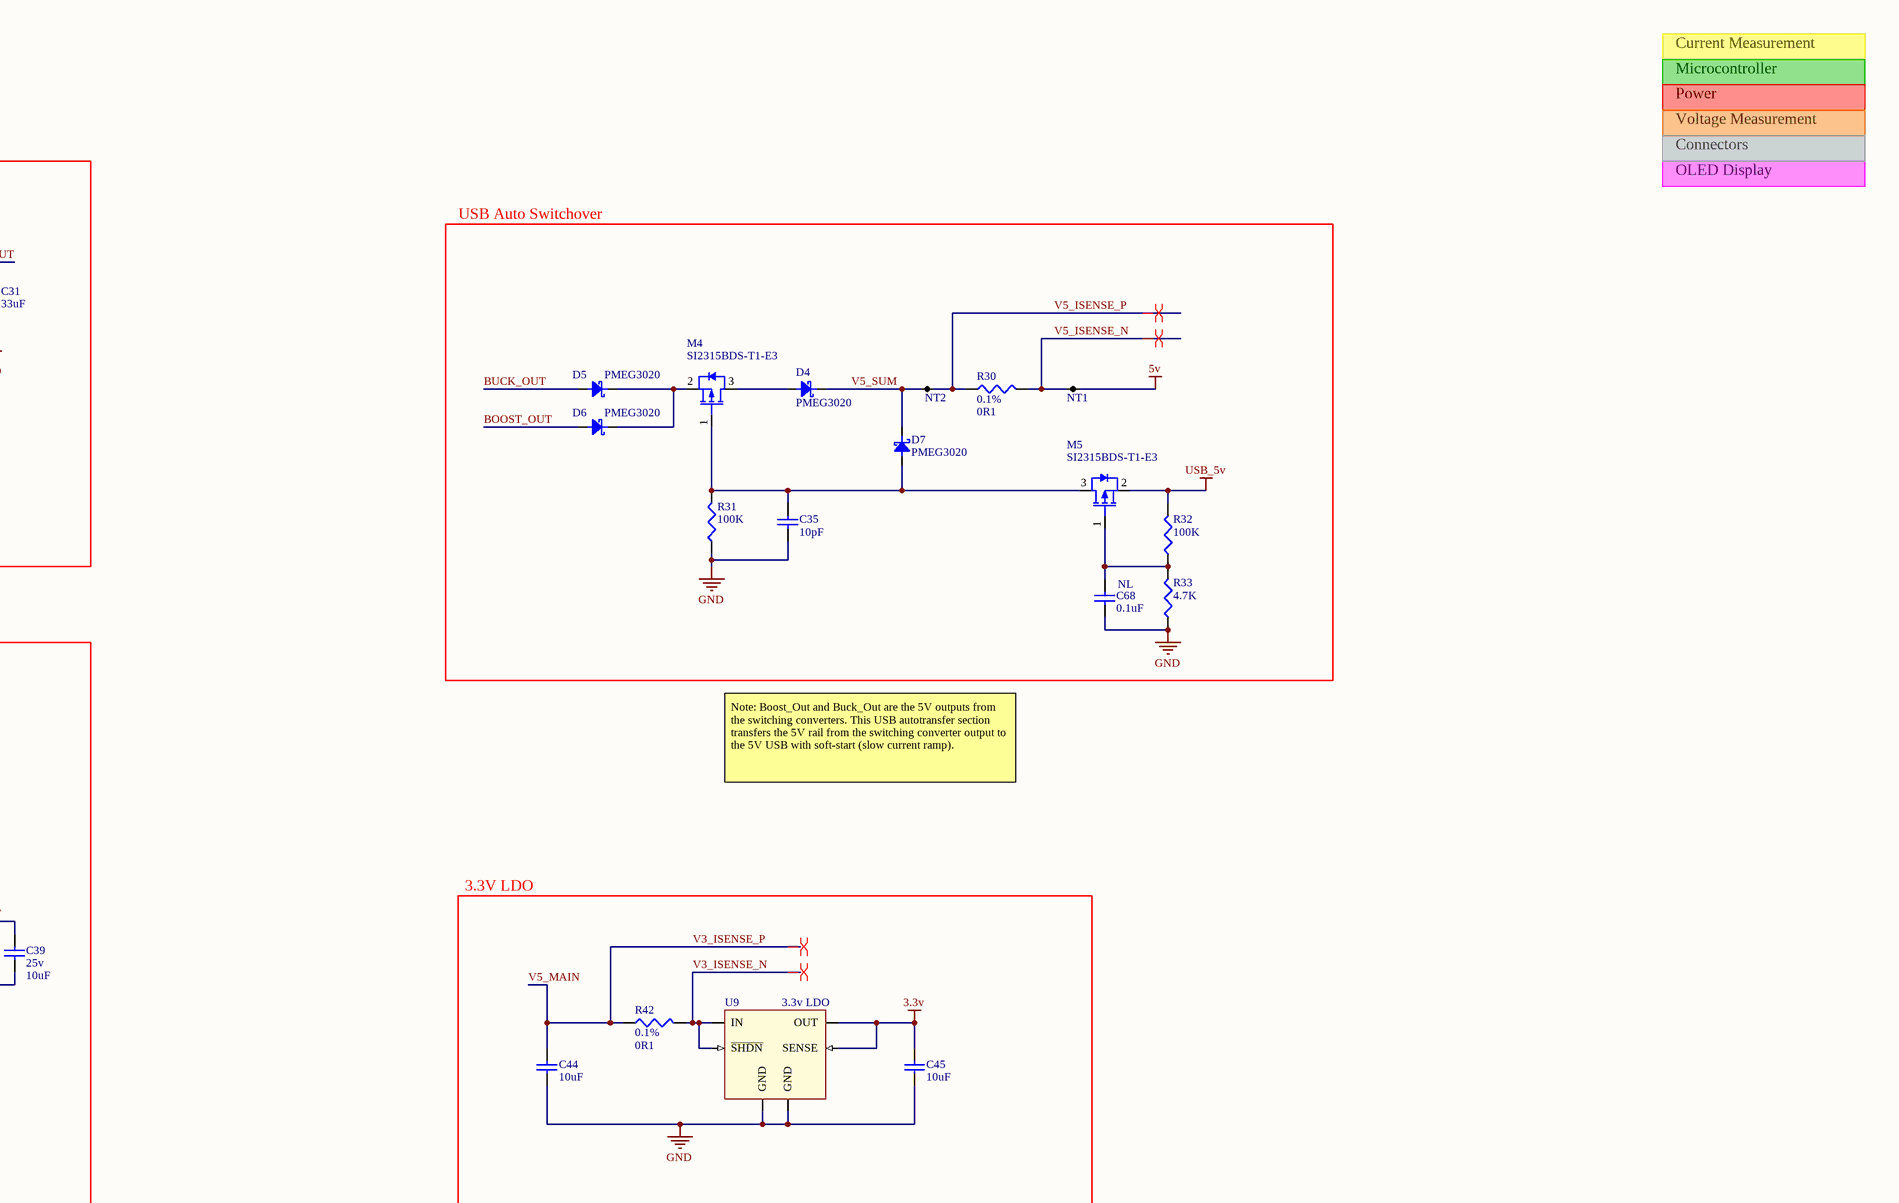
[diagram p10: Power.SchDoc, top right]
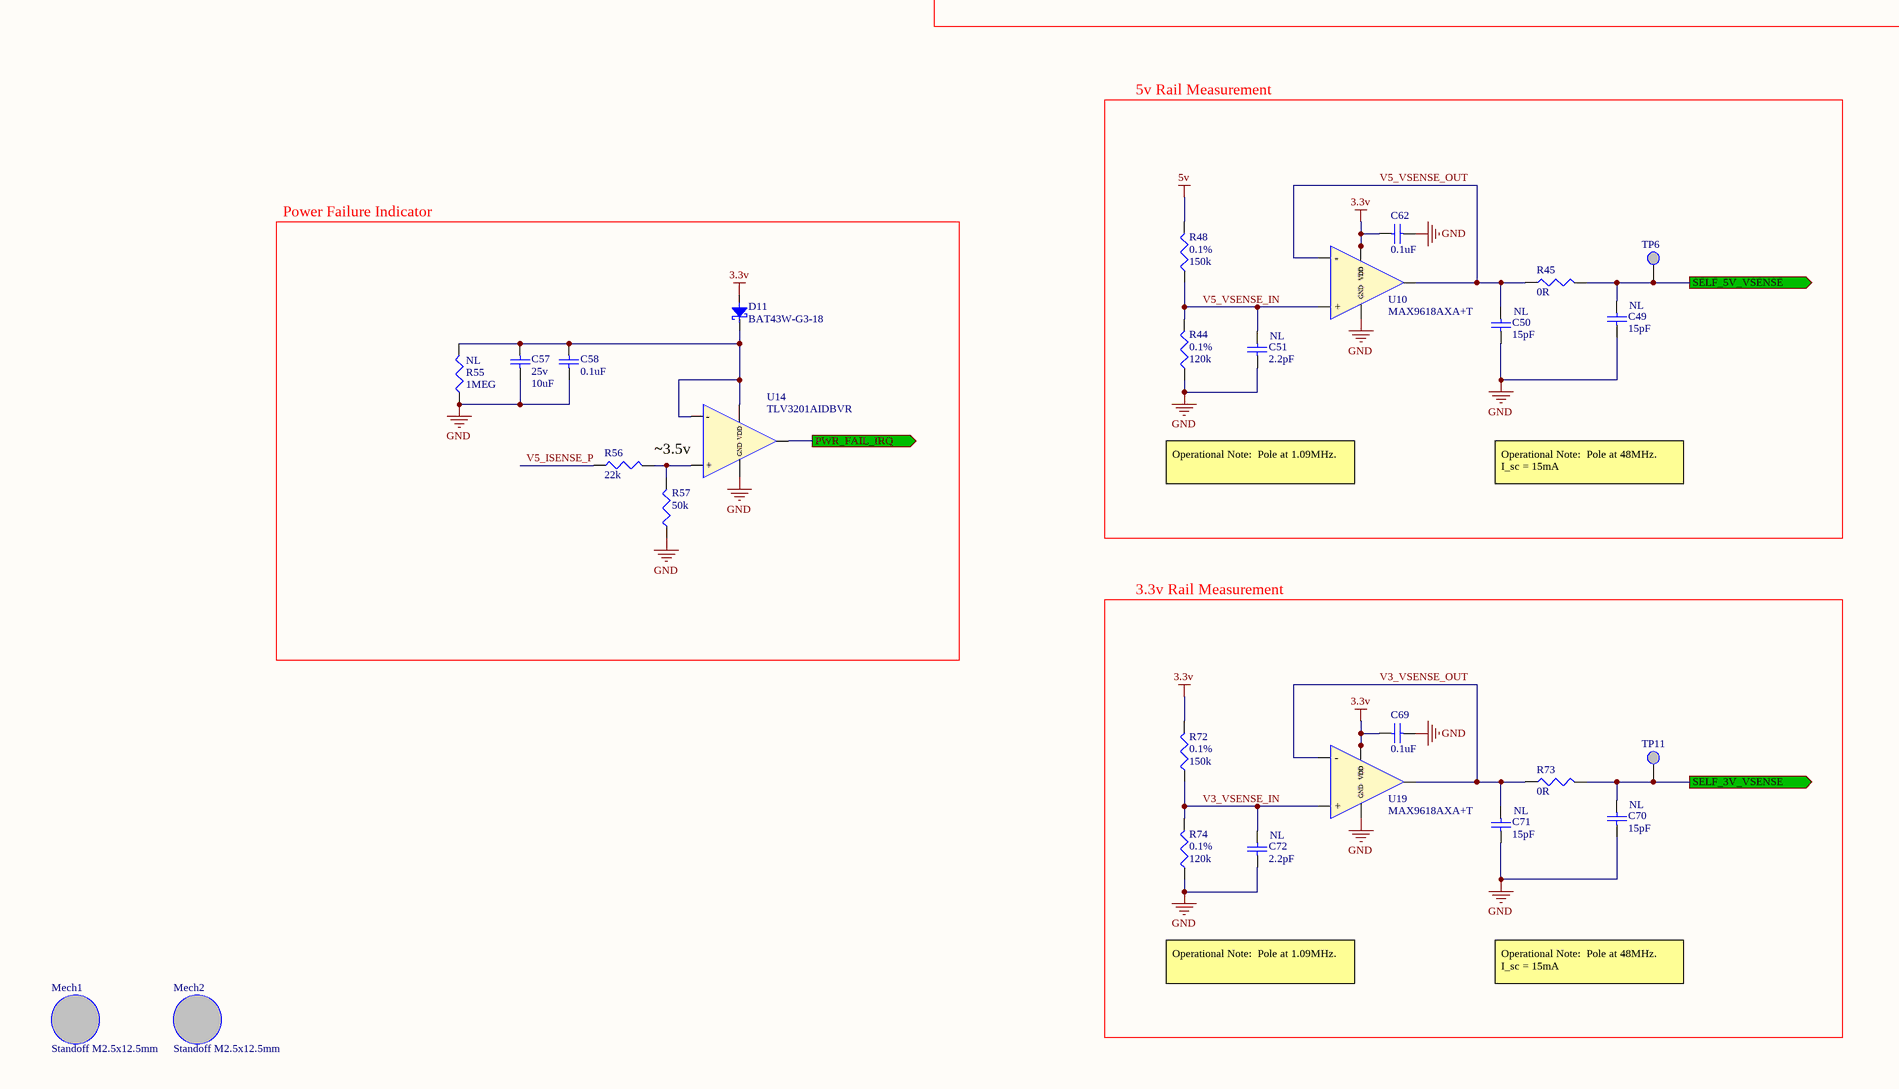
[diagram p11: Power.SchDoc, bottom left]
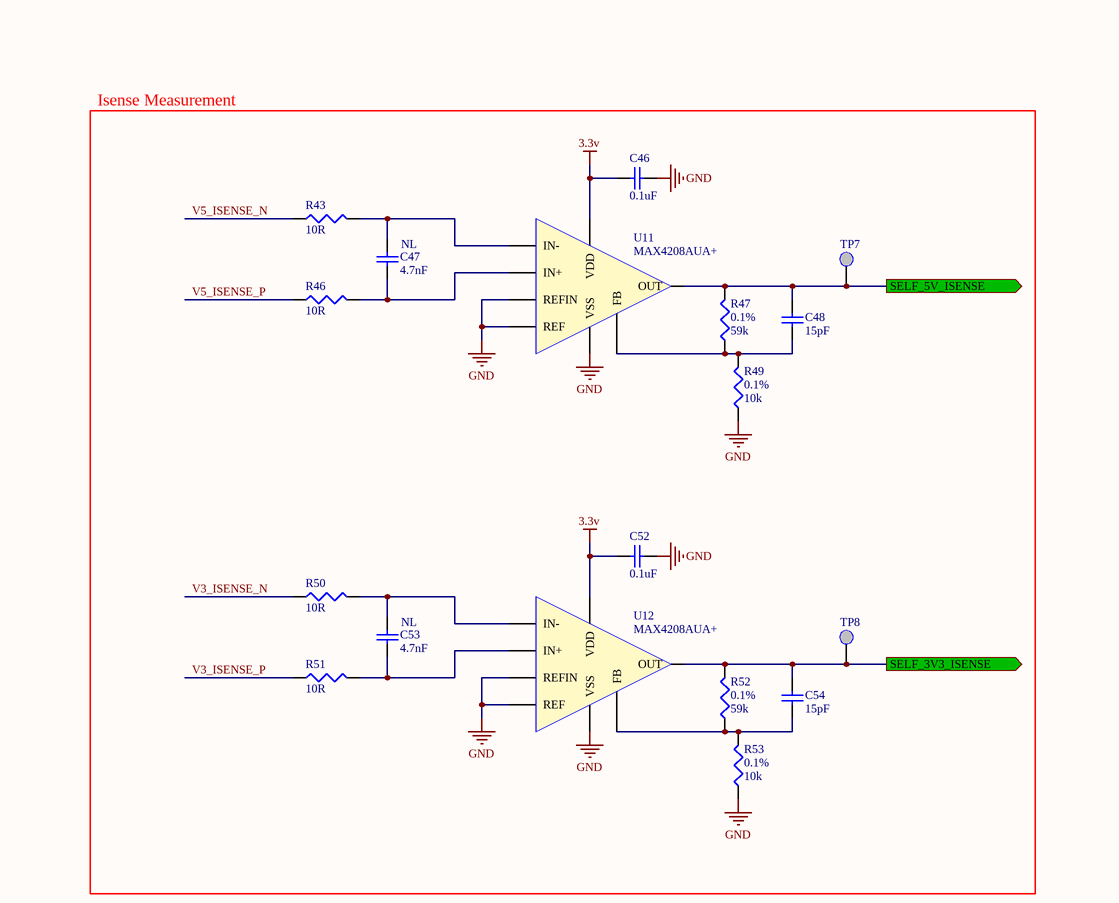
[diagram p12: Power.SchDoc, bottom right]

### Parts
C26  0.1uF  [CAP0603R]
C27  0.1uF  [CAP0603R]
C28  Voltage: 25v  [CAP1206W]  (hidden comment: 10uF)
C29  4.7nF  [CAP0402R]
C30  33uF  [CAP0805R]
C31  33uF  [CAP0805R]
C32  4.7nF  [CAP0402R]
C33  39pF  [CAP0402R]
C34  1nF  [CAP0402R]
C35  10pF  [CAP0402R]
C36  Voltage: 50v  [CAP1206R]  (hidden comment: 10uF)
C37  1nF  [CAP0402R]
C38  LOAD: NL  [CAP0402R]  (hidden comment: 0.1uF)
C39  Voltage: 25v  [CAP1206W]  (hidden comment: 10uF)
C40  0.1uF  [CAP0402R]
C41  0.47uF  [CAP0805R]
C42  4.7nF  [CAP0402R]
C43  0.1uF  [CAP0603R]
C44  10uF  [CAP0805R]
C45  10uF  [CAP0805R]
C46  0.1uF  [CAP0402R]
C47  LOAD: NL  [CAP0402R]  (hidden comment: 4.7nF)
C48  15pF  [CAP0402R]
C49  LOAD: NL  [CAP0402R]  (hidden comment: 15pF)
C50  LOAD: NL  [CAP0402R]  (hidden comment: 15pF)
C51  LOAD: NL  [CAP0402R]  (hidden comment: 2.2pF)
C52  0.1uF  [CAP0402R]
C53  LOAD: NL  [CAP0402R]  (hidden comment: 4.7nF)
C54  15pF  [CAP0402R]
C57  Voltage: 25v  [CAP1206W]  (hidden comment: 10uF)
C58  0.1uF  [CAP0402R]
C62  0.1uF  [CAP0402R]
C68  LOAD: NL  [CAP0402R]  (hidden comment: 0.1uF)
C69  0.1uF  [CAP0402R]
C70  LOAD: NL  [CAP0402R]  (hidden comment: 15pF)
C71  LOAD: NL  [CAP0402R]  (hidden comment: 15pF)
C72  LOAD: NL  [CAP0402R]  (hidden comment: 2.2pF)
D4  PMEG3020  [SOD-123]
D5  PMEG3020  [SOD-123]
D6  PMEG3020  [SOD-123]
D7  PMEG3020  [SOD-123]
D8  PMEG3050  [SOD128]
D9  PMEG3050  LOAD: NL  [SOD128]
D10  PMEG3050  [SOD128]
D11  BAT43W-G3-18  [SOD-123]
J1  39-29-3026  [1x2 MicroFit]
J2  39-29-3026  [1x2 MicroFit]
L1  6.8uH  [CDRH3D28NP-6R8NC]
L2  22uH  [Bourns_SRR1210]
M3  2N7002P,215  [SOT23-3M]  (value not drawn)
M4  SI2315BDS-T1-E3  [SOT23-3M]
M5  SI2315BDS-T1-E3  [SOT23-3M]
Mech1  Standoff M2.5x12.5mm  [Standoff M2.5x12mm]
Mech2  Standoff M2.5x12.5mm  [Standoff M2.5x12mm]
NT1  Net Tie  [Net Tie]  (value not drawn)  (net tie)
NT2  Net Tie  [Net Tie]  (value not drawn)  (net tie)
R10  100k  [RES0402R]
R11  1MEG  [RES0402R]
R12  100k  [RES0402R]
R14  100k  [RES0402R]
R15  10k  [RES0402R]
R16  1MEG  [RES0402R]
R25  1.8k  [RES0402R]
R29  49.9k  [RES0402R]
R30  Tolerance: 0.1%  [RES1206R]  (hidden comment: 0R1)
R31  100K  [RES0402R]
R32  100K  [RES0402R]
R33  4.7K  [RES0402R]
R34  0R  [RES1206W]
R35  50k  [RES0402R]
R36  127k  [RES0402R]
R37  2k  [RES0402R]
R38  100k  [RES0402R]
R39  10k  [RES0402R]
R40  4.99k  [RES0402R]
R41  49.9k  [RES0402R]
R42  Tolerance: 0.1%  [RES1206R]  (hidden comment: 0R1)
R43  10R  [RES0402R]
R44  Tolerance: 0.1%  [RES0603R]  (hidden comment: 120k)
R45  0R  [RES0402R]
R46  10R  [RES0402R]
R47  Tolerance: 0.1%  [RES0603R]  (hidden comment: 59k)
R48  Tolerance: 0.1%  [RES0603R]  (hidden comment: 150k)
R49  Tolerance: 0.1%  [RES0603R]  (hidden comment: 10k)
R50  10R  [RES0402R]
R51  10R  [RES0402R]
R52  Tolerance: 0.1%  [RES0603R]  (hidden comment: 59k)
R53  Tolerance: 0.1%  [RES0603R]  (hidden comment: 10k)
R55  Load: NL  [RES0402R]  (hidden comment: 1MEG)
R56  22k  [RES0603W]
R57  50k  [RES0402R]
R72  Tolerance: 0.1%  [RES0603R]  (hidden comment: 150k)
R73  0R  [RES0402R]
R74  Tolerance: 0.1%  [RES0603R]  (hidden comment: 120k)
TP2  NONE  [TESTPOINT - 1.5mm Round Pad]  (value not drawn)
TP3  NONE  [TESTPOINT - 1.5mm Round Pad]  (value not drawn)
TP4  NONE  [TESTPOINT - 1.5mm Round Pad]  (value not drawn)
TP5  NONE  [TESTPOINT - 1.5mm Round Pad]  (value not drawn)
TP6  NONE  [TESTPOINT - 1.5mm Round Pad]  (value not drawn)
TP7  NONE  [TESTPOINT - 1.5mm Round Pad]  (value not drawn)
TP8  NONE  [TESTPOINT - 1.5mm Round Pad]  (value not drawn)
TP11  NONE  [TESTPOINT - 1.5mm Round Pad]  (value not drawn)
U5  TPS54331DDAR  [HSOP-8]
U6  LM2903DR2G  [SOIC-8]  (parts A,B of 2)
U7  ADR5041  VOLTAGE: 2.5v  [SOT23-3M]
U8  TPS55332QPWPRQ1  [HTSSOP-20]
U9  3.3v LDO  [SOT-223-6]
U10  MAX9618AXA+T  [SC70]
U11  MAX4208AUA+  [uMAX8]
U12  MAX4208AUA+  [uMAX8]
U14  TLV3201AIDBVR  [SOT23-5]
U19  MAX9618AXA+T  [SC70]

### Blocks framed on the sheet
Converter Selection Controls: C26 M3 R10-R12 R14 R16 TP3 TP4 U6 U7
USB Auto Switchover: C35 C68 D4-D7 M4 M5 NT1 NT2 R30-R33
3.3V LDO: C44 C45 R42 U9
5v Rail Measurement: C49-C51 C62 R44 R45 R48 TP6 U10
Isense Measurement: C46-C48 C52-C54 R43 R46 R47 R49-R53 TP7 TP8 U11 U12
3.3v Rail Measurement: C69-C72 R72-R74 TP11 U19

### Ports
PWR_FAIL_IRQ (out), SELF_3V3_ISENSE (out), SELF_3V_VSENSE (out), SELF_5V_ISENSE (out), SELF_5V_VSENSE (out)

### Nets
3.3v: C45.1 C46.1 C52.1 C62.1 C69.1 D11.2(A) R72.2 U9.4(OUT) U9.5(SENSE) U10.5(VDD) U10.6(VDD) U11.8(VDD) U12.8(VDD) U19.5(VDD) U19.6(VDD)
5v: NT1.2 R48.2
GND: C26.1 C28.2 C29.1 C30.2 C31.2 C33.1 C34.2 C35.2 C36.2 C37.2 C38.2 C39.2 C41.1 C42.2 C43.2 C44.2 C45.2 C46.2 C49.2 C50.2 C51.2 C52.2 C57.2 C58.2 C62.2 C68.2 C69.2 C70.2 C71.2 C72.2 J1.2 J2.2 M3.2(SOURCE) R16.1 R25.1 R29.1 R31.1 R33.1 R38.1 R39.1 R40.1 R41.1 R44.1 R49.1 R53.1 R55.1 R57.1 R74.1 U5.7(GND) U5.9(PAD) U6.4(V-) U7.2(K) U8.0(PAD) U8.1(NC) U8.2(NC) U8.3(SYNC) U8.4(GND) U8.10(GND) U8.12(GND) U8.17(PGND) U9.3(GND) U9.6(GND) U10.2(GND) U11.1(REFIN) U11.4(VSS) U11.5(REF) U12.1(REFIN) U12.4(VSS) U12.5(REF) U14.2(GND) U19.2(GND)
USB_5v: M5.2(DRAIN) R32.2
V_BAT: C26.2 C28.1 C29.2 D8.2(A) J1.1 R10.2 R11.2 R12.2 R14.2 R34.2 U5.2(VIN) U6.8(V+)
V_DUT: J2.1
BOOST_EN: M3.3(DRAIN) R10.1 TP3.1 U8.5(E_N)
BOOST_OUT: C37.1 C38.1 C39.1 D6.2(A) D10.1(K) R35.2 R36.2 R37.1 TP5.1 U8.16(VREG)
BUCK_EN: TP4.1 U5.3(EN) U6.7(OUT)
BUCK_OUT: C30.1 C31.1 D5.2(A) L1.2 R15.2 TP2.1
PWR_FAIL_IRQ: U14.1(OUT) ; port PWR_FAIL_IRQ
SELF_3V3_ISENSE: C54.1 R52.2 TP8.1 U12.7(OUT) ; port SELF_3V3_ISENSE
SELF_3V3_VSENSE: C70.1 R73.2 TP11.1 ; port SELF_3V_VSENSE
SELF_5V_ISENSE: C48.1 R47.2 TP7.1 U11.7(OUT) ; port SELF_5V_ISENSE
SELF_5V_VSENSE: C49.1 R45.2 TP6.1 ; port SELF_5V_VSENSE
V3_ISENSE_N: R42.2 R50.1 U9.1(~{SHDN}) U9.2(IN)
V3_ISENSE_P: C44.1 R42.1 R51.1  [also labelled V5_MAIN]
V3_VSENSE_IN: C72.1 R72.1 R74.2 U19.1(+)
V3_VSENSE_OUT: C71.1 R73.1 U19.3(-) U19.4(OUT)
V5_ISENSE_N: NT1.1 R30.2 R43.1
V5_ISENSE_P: NT2.1 R30.1 R46.1 R56.1
V5_SUM: D4.1(K) D7.1(K) NT2.2
V5_VSENSE_IN: C51.1 R44.2 R48.1 U10.1(+)
V5_VSENSE_OUT: C50.1 R45.1 U10.3(-) U10.4(OUT)
NetC27_1: C27.1 U5.1(BOOT)
NetC27_2: C27.2 L1.1 U5.8(PH)
NetC32_1: C32.1 R29.2
NetC32_2: C32.2 C33.2 U5.6(COMP)
NetC34_1: C34.1 U5.4(SS)
NetC35_1: C35.1 D7.2(A) M4.1(GATE) M5.3(SOURCE) R31.2
NetC36_1: C36.1 D9.1(K) R34.1 U8.19(VIN)
NetC40_1: C40.1 U8.15(COMP)
NetC40_2: C40.2 R36.1 R38.2 U8.14(VSENSE)
NetC41_2: C41.2 U8.11(SS)
NetC42_1: C42.1 U8.9(CDLY)
NetC43_1: C43.1 U8.20(BOOT)
NetC47_1: C47.1 R43.2 U11.2(IN-)
NetC47_2: C47.2 R46.2 U11.3(IN+)
NetC48_2: C48.2 R47.1 R49.2 U11.6(FB)
NetC53_1: C53.1 R50.2 U12.2(IN-)
NetC53_2: C53.2 R51.2 U12.3(IN+)
NetC54_2: C54.2 R52.1 R53.2 U12.6(FB)
NetC57_1: C57.1 C58.1 D11.1(K) R55.2 U14.4(-) U14.5(VDD)
NetC68_1: C68.1 M5.1(GATE) R32.1 R33.2
NetD4_2: D4.2(A) M4.3(SOURCE)
NetD5_1: D5.1(K) D6.1(K) M4.2(DRAIN)
NetD8_1: D8.1(K) D9.2(A) L2.2
NetD10_2: D10.2(A) L2.1 U8.18(SW)
NetM3_1: M3.1(GATE) R14.1 U6.1(OUT1)
NetR11_1: R11.1 R16.2 U6.2(-) U6.6(-)
NetR12_1: R12.1 U6.3(+) U6.5(+) U7.1(A)
NetR15_1: R15.1 R25.2 U5.5(VSENSE)
NetR35_1: R35.1 R39.2 U8.13(RST_TH)
NetR37_2: R37.2 U8.8(~{RST})
NetR40_2: R40.2 U8.7(RSLEW)
NetR41_2: R41.2 U8.6(RT)
NetR56_2: R56.2 R57.2 U14.3(+)

Not connected (* = marked no-connect by the designer): Mech1 1; Mech2 1; U7 3(NC)

### Layout directives
differential pair: V3_ISENSE_N, V3_ISENSE_P, V5_ISENSE_N, V5_ISENSE_P

### Notes on the sheet
- Current Measurement
- Microcontroller
- Power
- Buck Converter
- Voltage Measurement
- Connectors
- OLED Display
- ~5.1v
- Boost Converter
- Power Connectors
- Note: Boost_Out and Buck_Out are the 5V outputs from the switching converters. This USB autotransfer section transfers the 5V rail from the switching converter output to the 5V USB with soft-start (slow current ramp).
- (near J1) From Battery
- (near J2) To DUT
- (near C40) ~2.465v
- Power Failure Indicator
- ~3.5v
- Operational Note:  Pole at 1.09MHz.
- Operational Note:  Pole at 48MHz.
  I_sc = 15mA

### Library data of the parts
C26 C27 C43 = 0.1uF 50v (0603): MFG_PN: VJ0603V104ZXAPW1BC; MFG: Vishay; Voltage: 50v; LOAD: NL; Value: 0.1uF
C28 C39 C57 = 10uF (1206): Tolerance: 10%; MFG_PN: GRJ31CR71E106KE11L; MFG: MURATA; LOAD: NL; Value: 10uF
C29 C32 = 4.7uF: Tolerance: 10%; MFG1_PN: C1005X7R1H472K050BA; MFG1: TDK; Voltage: 50v; Value: 4.7nF
C30 C31 = 33uF (0805): MFG_PN: C2012X5R1A336M125AC; MFG: TDK; Voltage: 10v; LOAD: NL; Value: 33uF
C33 = Generic Ceramic Capacitor: Tolerance: 5%; MFG1_PN: C1005C0G1H390J050BA; MFG1: TDK; Voltage: 50V; LOAD: NL; Value: 39pF
C34 C37 = 1nF (0402): as C61 on sheet Current Measurement; Value: 1nF
C35 = 10pF (0402): Tolerance: 5%; MFG_PN: VJ0402A100JXACW1BC; MFG: Vishay; Voltage: 50v; LOAD: NL; Value: 10pF
C36 = 10uF 50v (1206): Tolerance: 10%; MFG_PN: C3216X5R1H106K160AB; MFG: TDK; LOAD: NL; Value: 10uF
C38 C68 = 0.1uF (0402): Tolerance: 20%; MFG_PN: VJ0402G104MXQCW1BC; MFG: Vishay; Voltage: 10v; Value: 0.1uF
C40 C46 C52 C58 C62 C69 = 0.1uF (0402): as C59 on sheet Current Measurement; Value: 0.1uF
C41 = 0.47uF (0805): MFG_PN: VJ0805V474MXXCW1BC; MFG: Vishay; Voltage: 25v; LOAD: NL; Value: 0.47uF
C42 = 4.7nF (0402): Tolerance: 10%; MFG_PN: VJ0402Y472KXACW1BC; MFG: Vishay; Voltage: 50v; LOAD: NL; Value: 4.7nF
C44 C45 = Generic Ceramic Capacitor: Tolerance: 10%; MFG1_PN: C2012X5R1A106K125AB; MFG1: TDK; Voltage: 10V; LOAD: NL; Value: 10uF
C47 C53 = 4.7nF (0402): Tolerance: 10%; MFG_PN: VJ0402Y472KXACW1BC; MFG: Vishay; Voltage: 50v; Value: 4.7nF
C48 C54 = 15pF (0402): Tolerance: 5%; MFG_PN: VJ0402A150JXACW1BC; MFG: Vishay; Voltage: 50v; LOAD: NL; Value: 15pF
C49 C50 C70 C71 = 15pF (0402): Tolerance: 5%; MFG_PN: VJ0402A150JXACW1BC; MFG: Vishay; Voltage: 50v; Value: 15pF
C51 C72 = 2.2pF (0402): Tolerance: 10%; MFG_PN: VJ0402A2R2DXXCW1BC; MFG: Vishay; Voltage: 25v; Value: 2.2pF
D4-D7 = PMEG3020ER,115: Schottky Diode - 2A; MFG: NXP; VF: 365mV; LOAD: NL; Value: *; CURRENT: 2A; MFG_PN: PMEG3020ER,115
D8-D10 = PMEG3050BEP: MFG: NXP; CURRENT: 5A; VF: 0.45v; MFG_PN: PMEG3050BEP,115; Value: *
D11 = BAT43: MFG: Vishay; Value: *; MFG_PN: BAT43W-G3-18
J1 J2 = 1x2 Microfit: MFG: MOLEX; CURRENT: 9A; MFG_PN: 39-29-3026; MATES_WITH_HOUSING: 39-01-2020; MATES_WITH_PIN: 39-00-0038
L1 = 6.8uH Power Inductor: 6.8uH Shielded Power Inductor; MFG: SUMIDA; CURRENT: 1.32A; SHIELDED: TRUE; LOAD: NL; RESISTANCE: 119m; MFG_PN: CDRH3D28NP-6R8NC; Value: 6.8uH
L2 = 22uH_SRR1210: MFG: Bourns; MFG_PN: SRR1210-220M; CURRENT: 5.2A; Value: 22uH
M3 = 2N7002: NFET_SINGLE_360mA_60V; LOAD: NL; MFG: NXP; VDS_MAX: 60v; I_MAX: 360mA; VGS_MAX: 20v; P_MAX: *; RDS_ON: *; MFG_PN: 2N7002P,215
M4 M5 = Generic PFET: LOAD: NL; MFG: Vishay; VDS_MAX: 12V; I_MAX: 3A; VGS_MAX: 8V; P_MAX: 0.75W; RDS_ON: 50m; VGS_THRESHOLD: 0.9V; MFG_PN: SI2315BDS-T1-E3
Mech1 Mech2 = Standoff M2.5x12.5mm: MFG: KEYSTONE; MFG_PN: 24284
NT1 NT2 = Net Tie: Net Tie Testpoint w/ Hook; MFG_PN: 5015; MFG: KEYSTONE; LOAD: NL
R10 R12 R14 R38 = 100k (0402): Tolerance: 1%; POWER: 63mW; MFG_PN: CRCW0402100KFKED; MFG: Vishay; Load: NL; Value: 100k
R11 R16 = 1MEG (0402): Tolerance: 1%; POWER: 63mW; MFG_PN: CRCW04021M00FKED; MFG: Vishay; Load: NL; Value: 1MEG
R15 R39 = 10k (0402): as R59 on sheet Current Measurement; Value: 10k
R25 = 1.8k (0402): Tolerance: 1%; POWER: 63mW; MFG_PN: CRCW04021K80FKED; MFG: Vishay; Load: NL; Value: 1.8k
R29 R41 = 49.9k (0402): Tolerance: 1%; POWER: 63mW; MFG_PN: CRCW040249K9FKED; MFG: Vishay; Load: NL; Value: 49.9k
R30 R42 = 100m 0.1% (1206): POWER: 1W; MFG_PN: WSL1206R1000DEA; MFG: Vishay; Load: NL; Value: 0R1
R31 R32 = Generic Resistor: Tolerance: 1%; POWER: 1/16W; MFG_PN: CRCW0402100KFKED; MFG: Vishay; Load: NL; Value: 100K
R33 = Generic Resistor: Tolerance: 1%; POWER: 1/16W; MFG_PN: CRCW04024K70FKED; MFG: Vishay; Load: NL; Value: 4.7K
R34 = 0R (1206): 0R, 1206; MFG_PN: CRCW12060000Z0EA; MFG: Vishay; Load: NL; Value: 0R
R35 R57 = 50k (0402): Tolerance: 1%; POWER: 63mW; MFG_PN: CRCW040250K0FKED; MFG: Vishay; Load: NL; Value: 50k
R36 = 127k (0402): Tolerance: 1%; POWER: 63mW; MFG_PN: CRCW0402127KFKED; MFG: Vishay; Load: NL; Value: 127k
R37 = 2k (0402): Tolerance: 1%; POWER: 63mW; MFG_PN: CRCW04022K00FKED; MFG: Vishay; Load: NL; Value: 2k
R40 = 4.99k (0402): Tolerance: 1%; POWER: 63mW; MFG_PN: CRCW04024K99FKED; MFG: Vishay; Load: NL; Value: 4.99k
R43 R46 R50 R51 = 10R (0402): Tolerance: 1%; POWER: 63mW; MFG_PN: CRCW040210R0FKED; MFG: Vishay; Load: NL; Value: 10R
R44 R74 = 120k 0.1% (0603): POWER: 100mW; MFG_PN: TNPW0603120KBEEA; MFG: Vishay; Load: NL; Value: 120k
R45 R73 = 0R (0402): MFG_PN: CRCW04020000Z0ED; MFG: Vishay; Load: NL; Value: 0R
R47 R52 = 59k   0.1% (0603): POWER: 0.1W; MFG_PN: TNPW060359K0BEEA; MFG: Vishay; Load: NL; Value: 59k
R48 R72 = 150k 0.1% (0603): POWER: 100mW; MFG_PN: TNPW0603150KBEEA; MFG: Vishay; Load: NL; Value: 150k
R49 R53 = 10k   0.1% (0603): POWER: 0.1W; MFG_PN: TNPW060310K0BEEA; MFG: Vishay; Load: NL; Value: 10k
R55 = 1MEG (0402): as R20 on sheet Microcontroller; Value: 1MEG
R56 = 22k (0603): Tolerance: 1%; POWER: 0.1W; MFG_PN: CRCW060322K0FKEA; MFG: Vishay; Load: NL; Value: 22k
TP2-TP8 TP11 = Testpoint 1.5mm SMD: 1.5mm Testpoint
U5 = TPS54331: Buck Converter - Adj. Output - 3A Max; MFG: TI; VOUT: ADJ; VIN_MAX: 28v; LOAD: NL; MFG_PN: TPS54331DDAR; CURRENT: 3A
U6 = LM2903DR2G: Dual Comparator - Open Collector; MFG: ON SEMI; VMAX: 36v; VMIN: 2v; MFG_PN: LM2903DR2G; FUNCTION: *
U7 = ADR5045AKSZ: Precision 5v Reference; LOAD: NL; MFG: ANALOG DEVICES; IMIN: 15uA; IMAX: 15mA; MFG_PN: ADR5041BKSZ-REEL7
U8 = TPS55332QPWPRQ1: Boost Converter - Wide Input Voltage; LOAD: NL; MFG: TI; VIN_MAX: 40v; VIN_MIN: 1.5v; VOUT_MAX: 50V; VOUT_MIN: 2.5v; SWITCH_CURRENT: 5.7A; MFG_PN: TPS55332QPWPRQ1
U9 = TPS7A4533DCQR: MFG: TI; MFG_PN: TPS7A4533DCQR; FUNCTION: 3.3v LDO
U10 U19 = MAX9618AXA: Op Amp - 1 Channel Zero Drift; LOAD: NL; MFG: MAXIM; GBP: 1.5MHz; MFG_PN: MAX9618AXA+T
U11 U12 = MAX4208: Instrumentation Amplifier; MFG: MAXIM; GBP: 750KhZ; IN_BIAS_CURRENT: 1pA; IN_OFFSET_VOLTAGE: 3uV; GAIN: ADJ; IOUT_MAX: 25mA; I_QUIESCENT: 3mA; MFG_PN: MAX4208AUA+
U14 = TLV3201AIDBVR: High Speed Analog Comparator; LOAD: NL; MFG: TI; OUTPUT_TYPE: PUSH-PULL; RESPONSE_TIME: 47ns; MFG_PN: TLV3201AIDBVR

## Sheet Voltage Measurement.SchDoc
size B; DrawnBy: Ross Harvey; Engineer: Ross Harvey; Revision: A; SheetNumber: 5; SheetTotal: 7
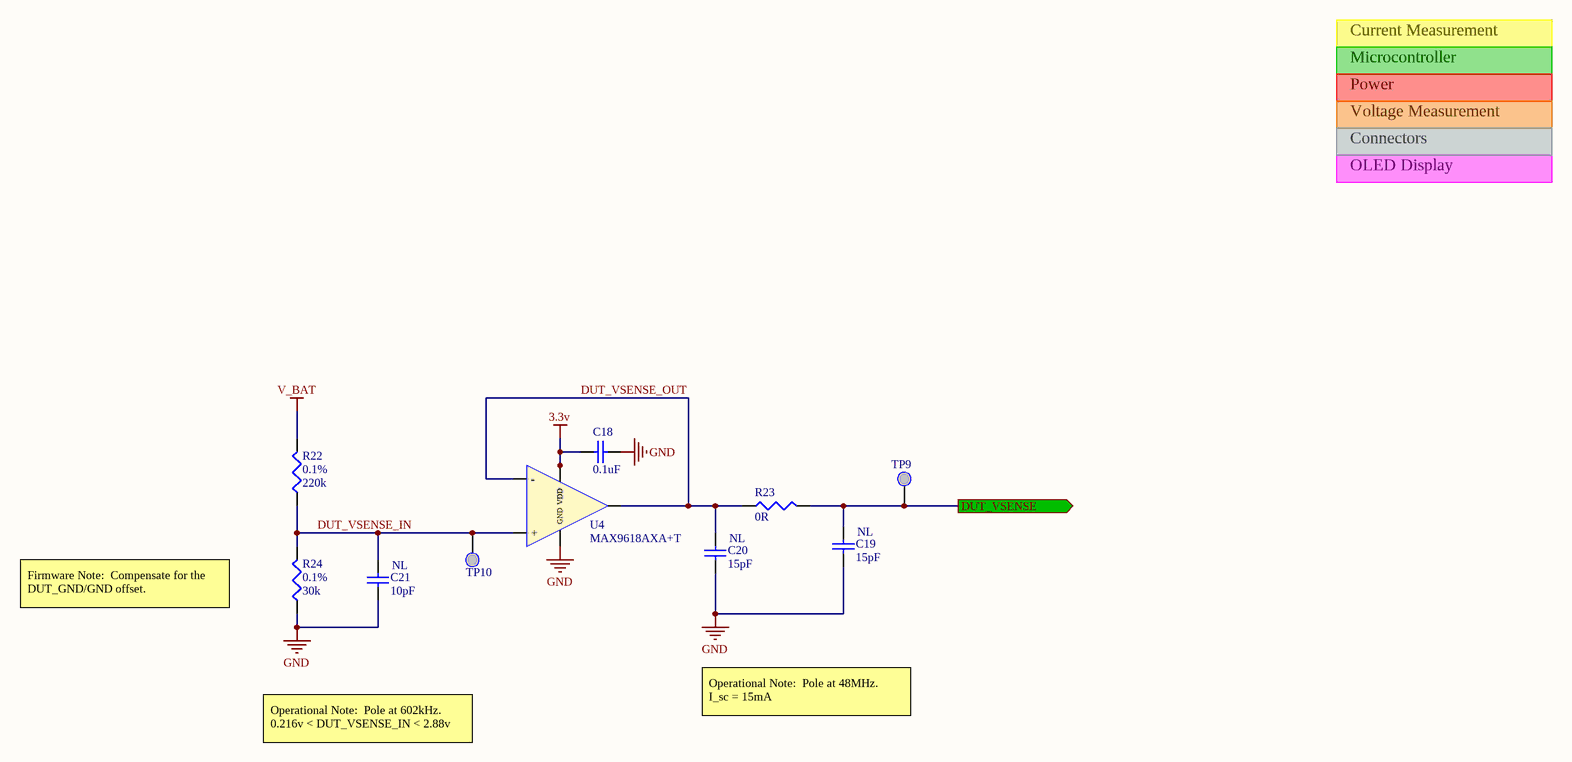
[diagram p13: Voltage Measurement.SchDoc]

### Parts
C18  0.1uF  [CAP0402R]
C19  LOAD: NL  [CAP0402R]  (hidden comment: 15pF)
C20  LOAD: NL  [CAP0402R]  (hidden comment: 15pF)
C21  LOAD: NL  [CAP0402R]  (hidden comment: 10pF)
R22  Tolerance: 0.1%  [RES0603R]  (hidden comment: 220k)
R23  0R  [RES0402R]
R24  Tolerance: 0.1%  [RES0603R]  (hidden comment: 30k)
TP9  NONE  [TESTPOINT - 1.5mm Round Pad]  (value not drawn)
TP10  NONE  [TESTPOINT - 1.5mm Round Pad]  (value not drawn)
U4  MAX9618AXA+T  [SC70]

### Ports
DUT_VSENSE (out)

### Nets
3.3v: C18.1 U4.5(VDD) U4.6(VDD)
GND: C18.2 C19.2 C20.2 C21.2 R24.1 U4.2(GND)
V_BAT: R22.2
DUT_VSENSE: C19.1 R23.2 TP9.1 ; port DUT_VSENSE
DUT_VSENSE_IN: C21.1 R22.1 R24.2 TP10.1 U4.1(+)
DUT_VSENSE_OUT: C20.1 R23.1 U4.3(-) U4.4(OUT)

### Notes on the sheet
- Current Measurement
- Microcontroller
- Power
- Voltage Measurement
- OLED Display
- Connectors
- Firmware Note:  Compensate for the DUT_GND/GND offset.
- Operational Note:  Pole at 48MHz.
  I_sc = 15mA
- Operational Note:  Pole at 602kHz.
  0.216v < DUT_VSENSE_IN < 2.88v

### Library data of the parts
C18 = 0.1uF (0402): as C59 on sheet Current Measurement; Value: 0.1uF
C19 C20 = 15pF (0402): as C49 on sheet Power; Value: 15pF
C21 = 10pF (0402): Tolerance: 5%; MFG_PN: VJ0402A100JXACW1BC; MFG: Vishay; Voltage: 50v; Value: 10pF
R22 = 220k 0.1% (0603): POWER: 0.1W; MFG1_PN: TNPW0603220KBEEA; MFG1: Vishay; Load: NL; Value: 220k
R23 = 0R (0402): as R45 on sheet Power; Value: 0R
R24 = 30k 0.1% (0603): POWER: 0.1W; MFG1_PN: TNPW060330K0BEEA; MFG1: Vishay; Load: NL; Value: 30k
TP9 TP10 = Testpoint 1.5mm SMD: 1.5mm Testpoint
U4 = MAX9618AXA: as U10 on sheet Power; MFG_PN: MAX9618AXA+T

## Sheet OLED Display.SchDoc
size B; SheetNumber: 7; SheetTotal: 7
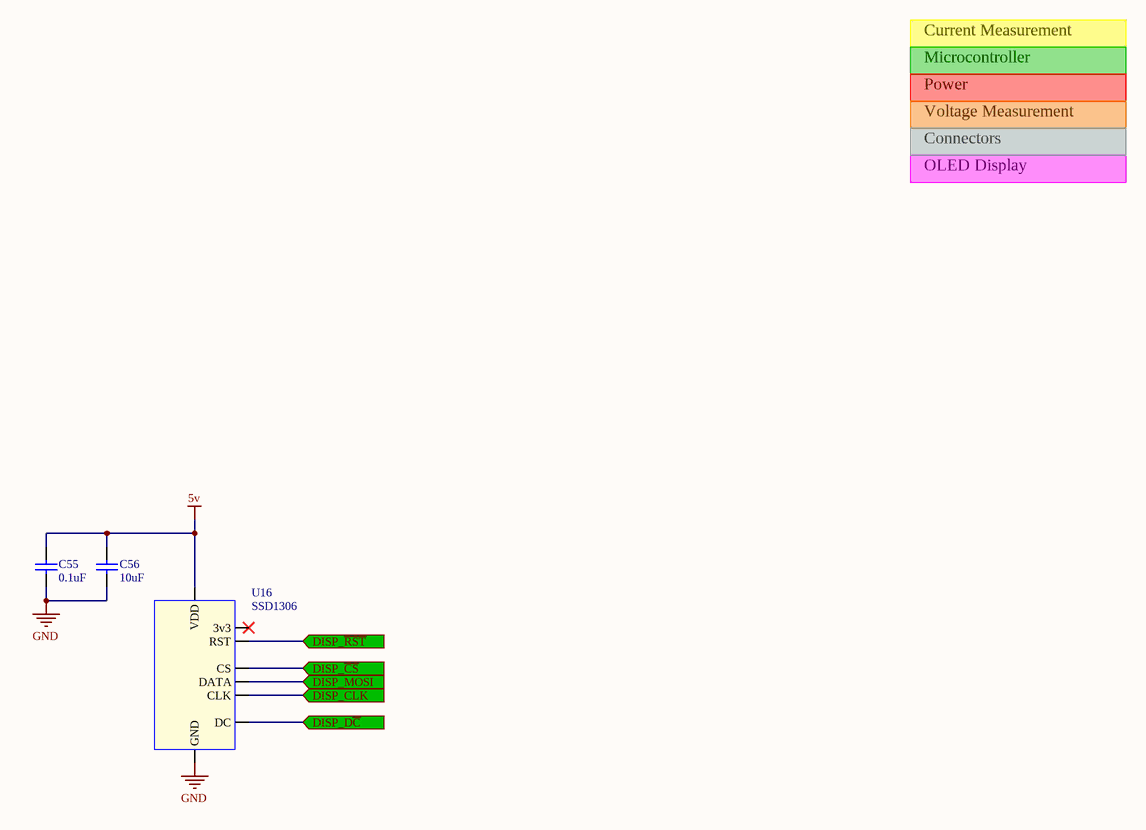
[diagram p14: OLED Display.SchDoc]

### Parts
C55  0.1uF  [CAP0402R]
C56  10uF  [CAP1206R]
U16  SSD1306  [SSD1306]

### Ports
DISP_CLK (in), DISP_D~{C} (in), DISP_MOSI (in), DISP_~{CS} (in), DISP_~{RST} (in)

### Nets
5v: C55.1 C56.1 U16.7(VDD)
GND: C55.2 C56.2 U16.8(GND)
DISP_~{CS}: U16.5(CS) ; port DISP_~{CS}
DISP_CLK: U16.2(CLK) ; port DISP_CLK
DISP_MOSI: U16.1(DATA) ; port DISP_MOSI
NetU1_79: U16.4(RST) ; port DISP_~{RST}
NetU1_80: U16.3(DC) ; port DISP_D~{C}

Not connected (* = marked no-connect by the designer): U16 6(3v3)*

### Notes on the sheet
- Current Measurement
- Microcontroller
- Power
- Voltage Measurement
- OLED Display
- Connectors

### Library data of the parts
C55 = 0.1uF (0402): as C59 on sheet Current Measurement; Value: 0.1uF
C56 = 10uF: MFG1_PN: VJ1206V106ZXQTW1BC; MFG1: Vishay; Value: 10uF
U16 = SSD1306: OLED Display; MFG: ADAFRUIT; MFG_PN: SSD1306

## Nets that join several sheets
3.3v: Current Measurement (8 pins), Microcontroller (30 pins), Power (15 pins), Voltage Measurement (C18.1 U4.5 U4.6)
5v: Microcontroller (C9.1 U3.1), Power (NT1.2 R48.2), OLED Display (C55.1 C56.1 U16.7)
GND: Current Measurement (20 pins), Microcontroller (63 pins), Power (71 pins), Voltage Measurement (6 pins), OLED Display (C55.2 C56.2 U16.8)
USB_5v: Microcontroller (6 pins), Power (M5.2 R32.2)
V_BAT: Current Measurement (15 pins), Power (12 pins), Voltage Measurement (R22.2)
V_DUT: Current Measurement (7 pins), Power (J2.1)
DISP_~{CS}: Microcontroller (J5.3 U1.97), OLED Display (U16.5)
DISP_CLK: Microcontroller (J5.5 R75.2), OLED Display (U16.2)
DISP_MOSI: Microcontroller (J5.7 R76.2), OLED Display (U16.1)
DUT_ISENSE0: Current Measurement (C67.2 U18.9), Microcontroller (U1.54)
DUT_ISENSE1: Current Measurement (C66.2 U17.9), Microcontroller (U1.56)
DUT_ISENSE2: Current Measurement (C63.2 U15.9), Microcontroller (U1.55)
DUT_ISENSE3: Current Measurement (C61.2 U13.9), Microcontroller (U1.70)
DUT_ISENSE_RANGE0: Current Measurement (R67.1 R69.2 U18.6), Microcontroller (M2.2 U1.72)
DUT_ISENSE_RANGE2: Current Measurement (R54.1 R59.2 U15.6), Microcontroller (M2.5 U1.73)
DUT_ISENSE_RANGE3: Current Measurement (R60.1 R61.2 U13.6), Microcontroller (M12.5 U1.77)
DUT_VSENSE: Microcontroller (U1.53), Voltage Measurement (C19.1 R23.2 TP9.1)
NetU1_79: Microcontroller (U1.79), OLED Display (U16.4)
NetU1_80: Microcontroller (U1.80), OLED Display (U16.3)
PWR_FAIL_IRQ: Microcontroller (U1.39), Power (U14.1)
SELF_3V3_ISENSE: Microcontroller (U1.81), Power (C54.1 R52.2 TP8.1 U12.7)
SELF_3V3_VSENSE: Microcontroller (U1.58), Power (C70.1 R73.2 TP11.1)
SELF_5V_ISENSE: Microcontroller (U1.83), Power (C48.1 R47.2 TP7.1 U11.7)
SELF_5V_VSENSE: Microcontroller (U1.82), Power (C49.1 R45.2 TP6.1)